# EAGLE schematic 4x16MUX_3 (EAGLE 6.5.0)

## Sheet 1 of 14
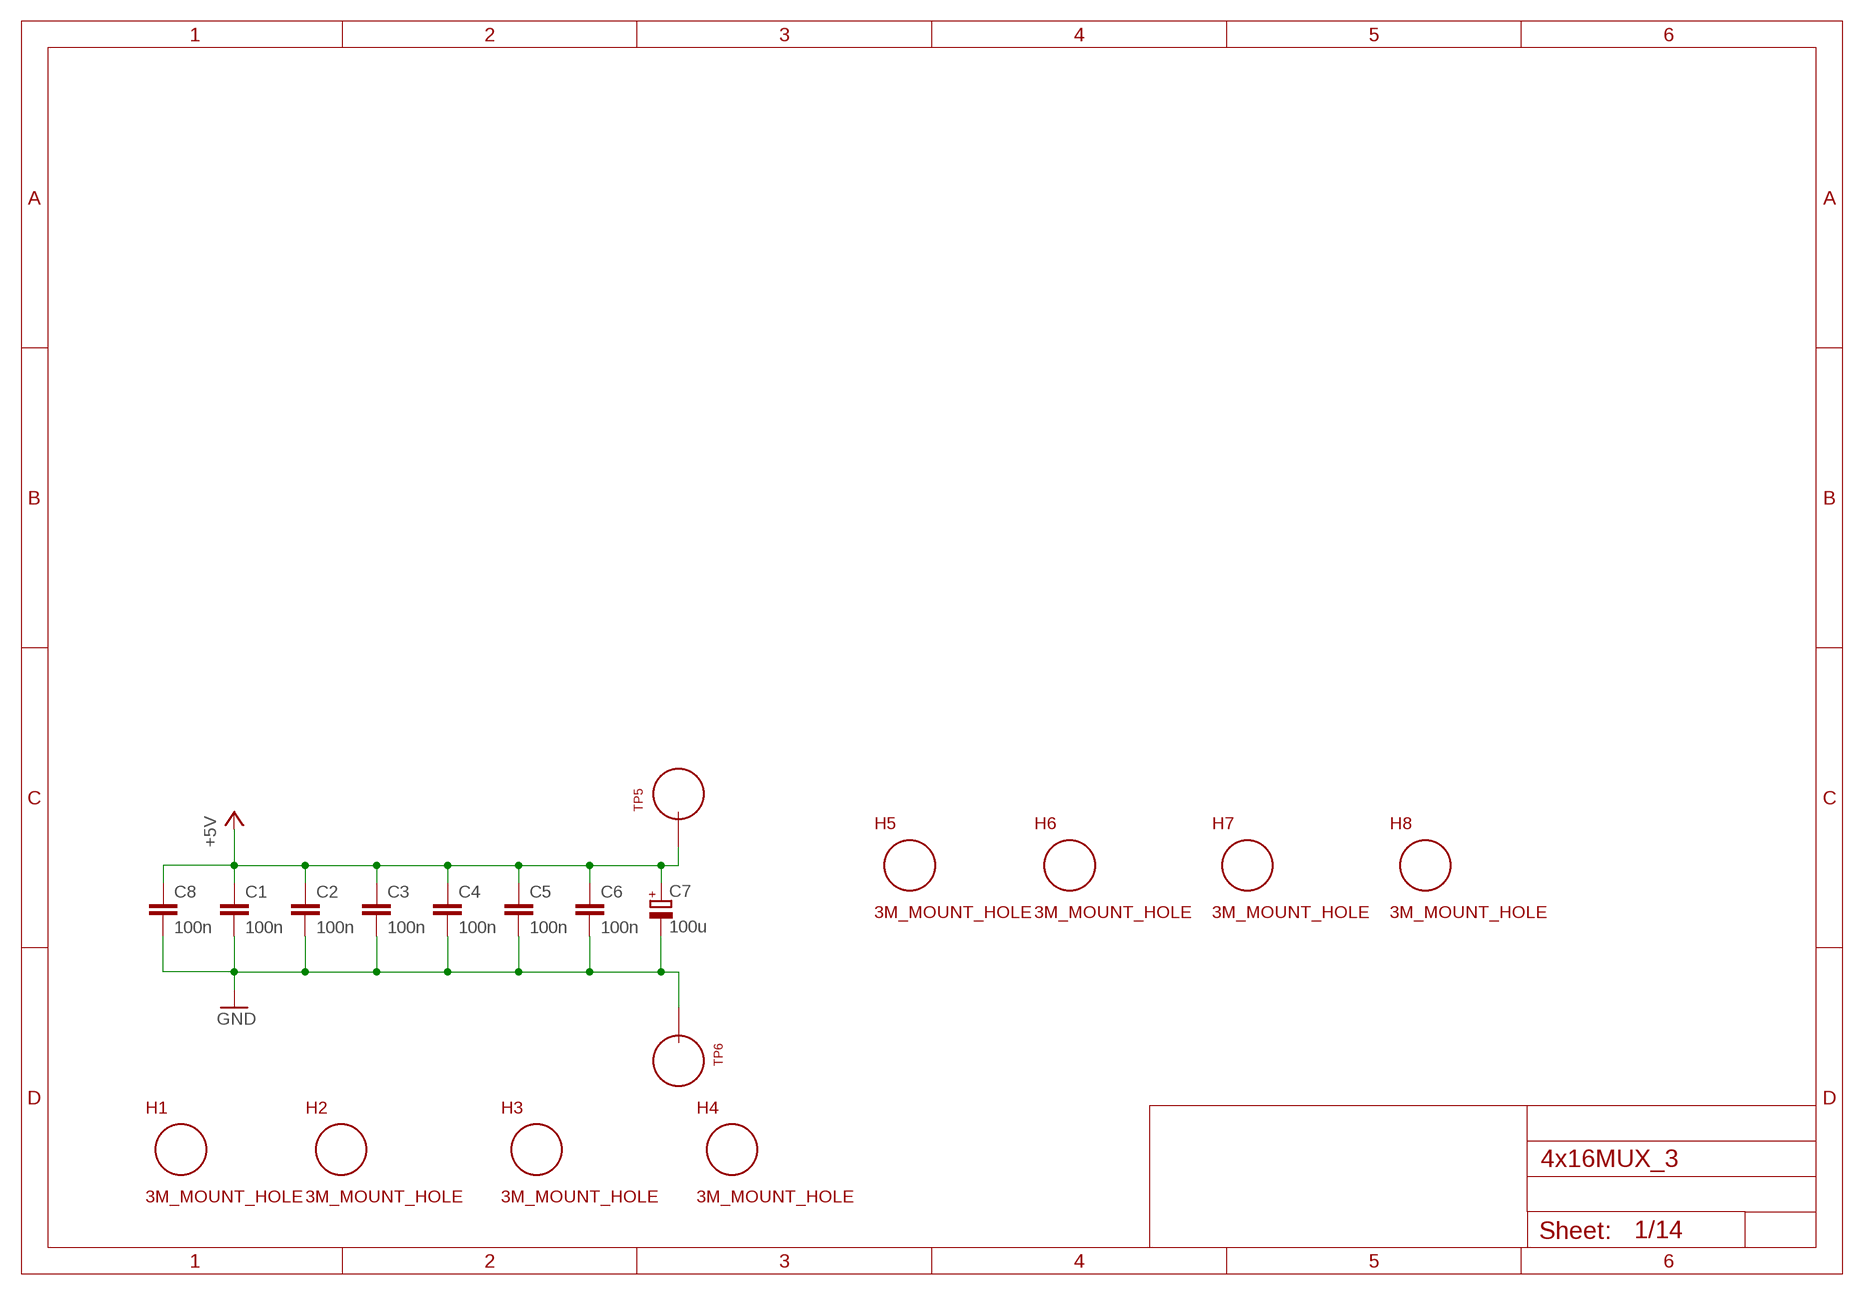
[diagram p0: schematic, sheet 1]

### Parts
C1  100n  C_P2INCH  [CAP_P2INCH]
C2  100n  C_P2INCH  [CAP_P2INCH]
C3  100n  C_P2INCH  [CAP_P2INCH]
C4  100n  C_P2INCH  [CAP_P2INCH]
C5  100n  C_P2INCH  [CAP_P2INCH]
C6  100n  C_P2INCH  [CAP_P2INCH]
C7  100u  POLARISED_CAP_2P5_6P3MM  [POLARISED_CAP_2P5_6P3MM]
C8  100n  C_P2INCH  [CAP_P2INCH]
H1  3M_MOUNT_HOLE  [3M_HOLE]
H2  3M_MOUNT_HOLE  [3M_HOLE]
H3  3M_MOUNT_HOLE  [3M_HOLE]
H4  3M_MOUNT_HOLE  [3M_HOLE]
H5  3M_MOUNT_HOLE  [3M_HOLE]
H6  3M_MOUNT_HOLE  [3M_HOLE]
H7  3M_MOUNT_HOLE  [3M_HOLE]
H8  3M_MOUNT_HOLE  [3M_HOLE]
TP5  TEST_LOOP  [TEST_LOOP]
TP6  TEST_LOOP  [TEST_LOOP]

### Nets
+5V: C1.1 C2.1 C3.1 C4.1 C5.1 C6.1 C7.A C8.1 TP5.P$1 ; also sheet 2,3,4,5,6,7,8,9,10,11,12,13,14
GND: C1.2 C2.2 C3.2 C4.2 C5.2 C6.2 C7.K C8.2 TP6.P$1 ; also sheet 2,3,4,5,6,7,8,9,10,11,12,13,14

## Sheet 2 of 14
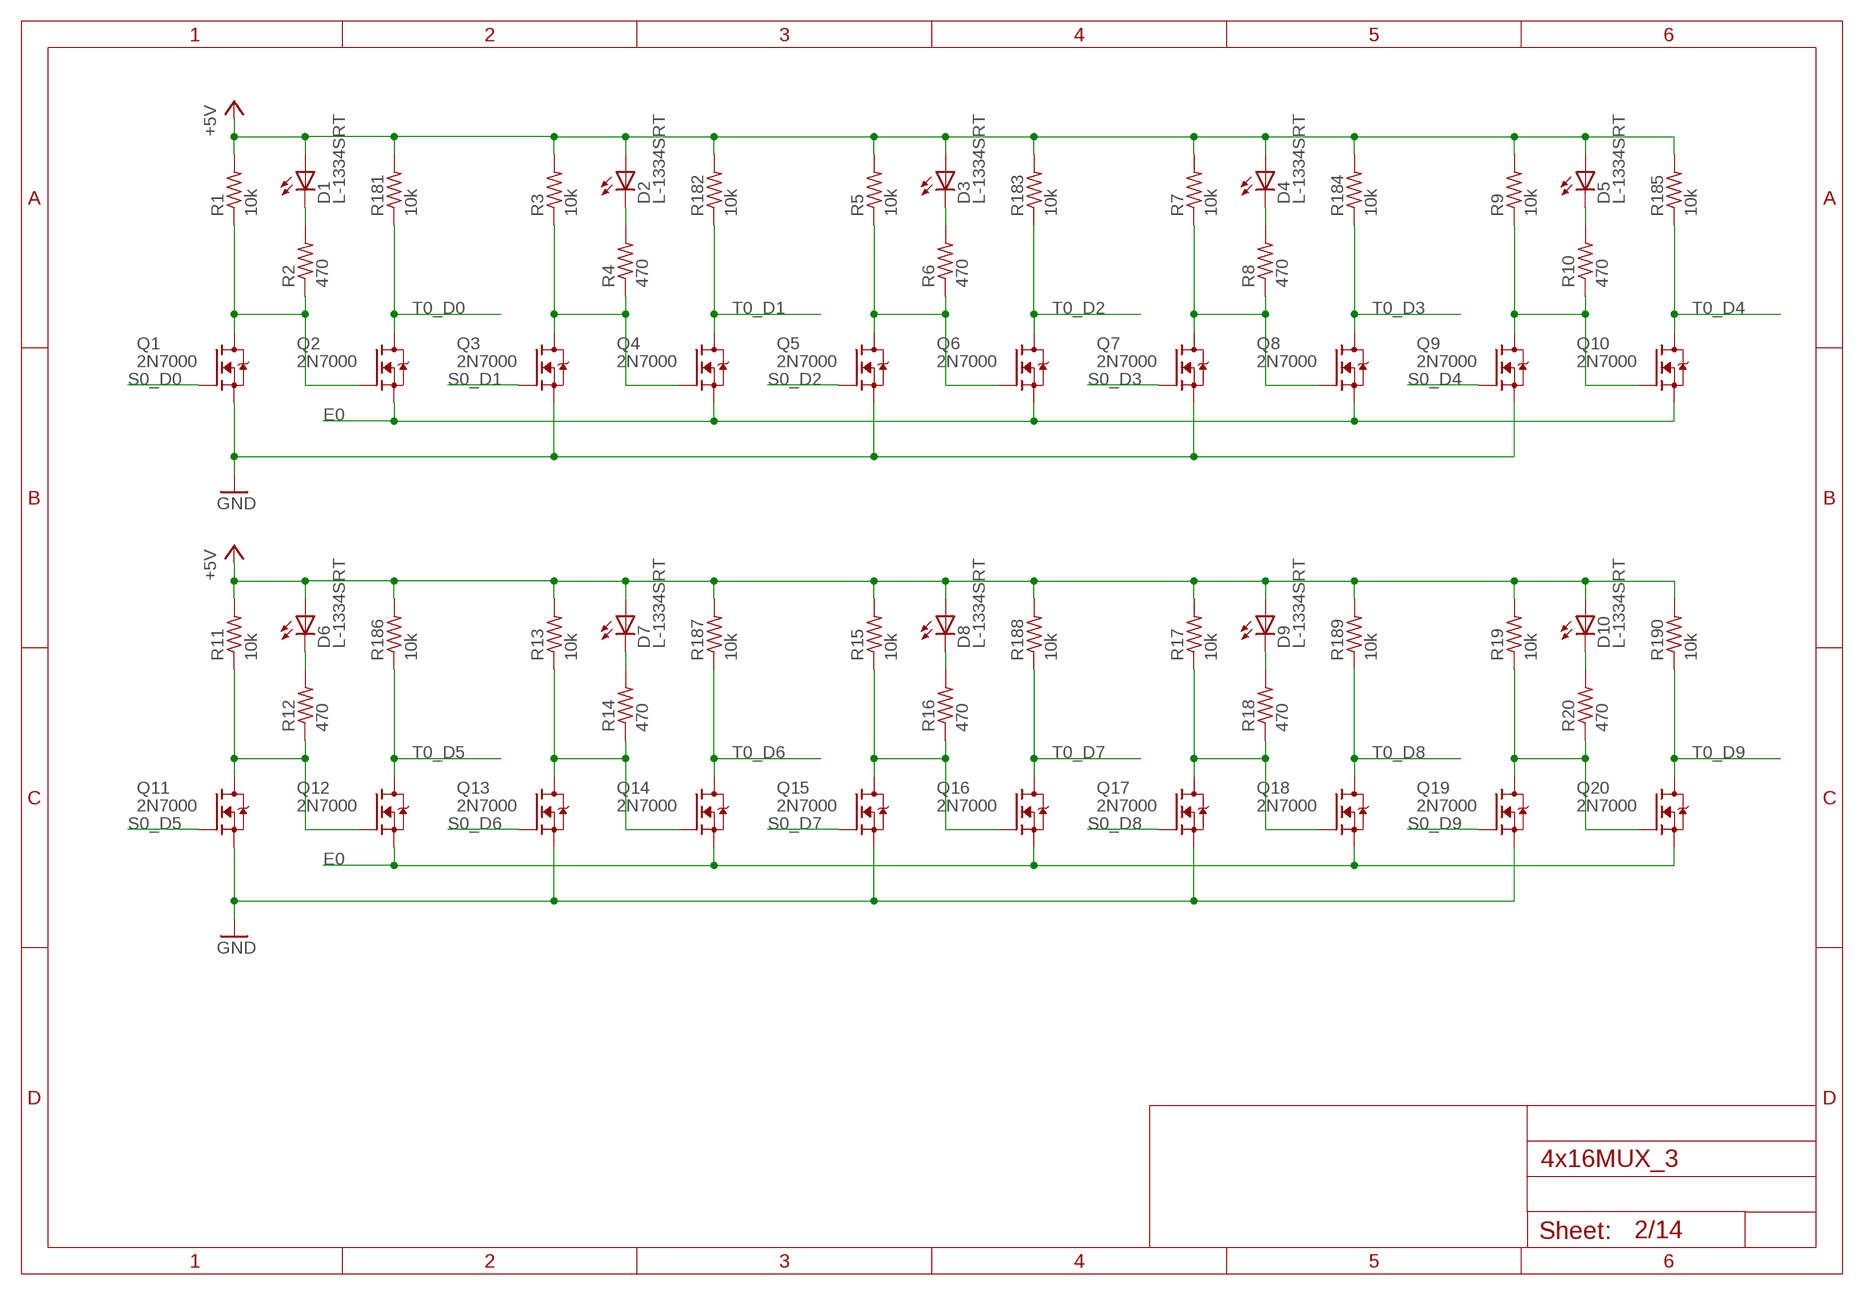
[diagram p1: schematic, sheet 2]

### Parts
D1  L-1334SRT  [LED3MM]
D2  L-1334SRT  [LED3MM]
D3  L-1334SRT  [LED3MM]
D4  L-1334SRT  [LED3MM]
D5  L-1334SRT  [LED3MM]
D6  L-1334SRT  [LED3MM]
D7  L-1334SRT  [LED3MM]
D8  L-1334SRT  [LED3MM]
D9  L-1334SRT  [LED3MM]
D10  L-1334SRT  [LED3MM]
Q1  2N7000  [TO92-DGS]
Q2  2N7000  [TO92-DGS]
Q3  2N7000  [TO92-DGS]
Q4  2N7000  [TO92-DGS]
Q5  2N7000  [TO92-DGS]
Q6  2N7000  [TO92-DGS]
Q7  2N7000  [TO92-DGS]
Q8  2N7000  [TO92-DGS]
Q9  2N7000  [TO92-DGS]
Q10  2N7000  [TO92-DGS]
Q11  2N7000  [TO92-DGS]
Q12  2N7000  [TO92-DGS]
Q13  2N7000  [TO92-DGS]
Q14  2N7000  [TO92-DGS]
Q15  2N7000  [TO92-DGS]
Q16  2N7000  [TO92-DGS]
Q17  2N7000  [TO92-DGS]
Q18  2N7000  [TO92-DGS]
Q19  2N7000  [TO92-DGS]
Q20  2N7000  [TO92-DGS]
R1  10k  R_P2INCH  [R_P2INCH]
R2  470  R_P2INCH  [R_P2INCH]
R3  10k  R_P2INCH  [R_P2INCH]
R4  470  R_P2INCH  [R_P2INCH]
R5  10k  R_P2INCH  [R_P2INCH]
R6  470  R_P2INCH  [R_P2INCH]
R7  10k  R_P2INCH  [R_P2INCH]
R8  470  R_P2INCH  [R_P2INCH]
R9  10k  R_P2INCH  [R_P2INCH]
R10  470  R_P2INCH  [R_P2INCH]
R11  10k  R_P2INCH  [R_P2INCH]
R12  470  R_P2INCH  [R_P2INCH]
R13  10k  R_P2INCH  [R_P2INCH]
R14  470  R_P2INCH  [R_P2INCH]
R15  10k  R_P2INCH  [R_P2INCH]
R16  470  R_P2INCH  [R_P2INCH]
R17  10k  R_P2INCH  [R_P2INCH]
R18  470  R_P2INCH  [R_P2INCH]
R19  10k  R_P2INCH  [R_P2INCH]
R20  470  R_P2INCH  [R_P2INCH]
R181  10k  R_P2INCH  [R_P2INCH]
R182  10k  R_P2INCH  [R_P2INCH]
R183  10k  R_P2INCH  [R_P2INCH]
R184  10k  R_P2INCH  [R_P2INCH]
R185  10k  R_P2INCH  [R_P2INCH]
R186  10k  R_P2INCH  [R_P2INCH]
R187  10k  R_P2INCH  [R_P2INCH]
R188  10k  R_P2INCH  [R_P2INCH]
R189  10k  R_P2INCH  [R_P2INCH]
R190  10k  R_P2INCH  [R_P2INCH]

### Nets
+5V: D1.A D2.A D3.A D4.A D5.A D6.A D7.A D8.A D9.A D10.A R1.2 R3.2 R5.2 R7.2 R9.2 R11.2 R13.2 R15.2 R17.2 R19.2 R181.2 R182.2 R183.2 R184.2 R185.2 R186.2 R187.2 R188.2 R189.2 R190.2 ; also sheet 1,3,4,5,6,7,8,9,10,11,12,13,14
E0: Q2.S Q4.S Q6.S Q8.S Q10.S Q12.S Q14.S Q16.S Q18.S Q20.S ; also sheet 3
GND: Q1.S Q3.S Q5.S Q7.S Q9.S Q11.S Q13.S Q15.S Q17.S Q19.S ; also sheet 1,3,4,5,6,7,8,9,10,11,12,13,14
N$1: Q3.D Q4.G R3.1 R4.1
N$2: Q1.D Q2.G R1.1 R2.1
N$3: D1.K(C) R2.2
N$4: D2.K(C) R4.2
N$5: Q5.D Q6.G R5.1 R6.1
N$6: D3.K(C) R6.2
N$7: Q7.D Q8.G R7.1 R8.1
N$8: D4.K(C) R8.2
N$9: Q9.D Q10.G R9.1 R10.1
N$10: D5.K(C) R10.2
N$12: Q11.D Q12.G R11.1 R12.1
N$13: D6.K(C) R12.2
N$14: Q13.D Q14.G R13.1 R14.1
N$15: D7.K(C) R14.2
N$16: Q15.D Q16.G R15.1 R16.1
N$17: D8.K(C) R16.2
N$18: Q17.D Q18.G R17.1 R18.1
N$19: D9.K(C) R18.2
N$20: Q19.D Q20.G R19.1 R20.1
N$21: D10.K(C) R20.2
S0_D0: Q1.G ; also sheet 3
S0_D1: Q3.G ; also sheet 3
S0_D2: Q5.G ; also sheet 3
S0_D3: Q7.G ; also sheet 3
S0_D4: Q9.G ; also sheet 3
S0_D5: Q11.G ; also sheet 3
S0_D6: Q13.G ; also sheet 3
S0_D7: Q15.G ; also sheet 3
S0_D8: Q17.G ; also sheet 3
S0_D9: Q19.G ; also sheet 3
T0_D0: Q2.D R181.1 ; also sheet 10
T0_D1: Q4.D R182.1 ; also sheet 10
T0_D2: Q6.D R183.1 ; also sheet 10
T0_D3: Q8.D R184.1 ; also sheet 10
T0_D4: Q10.D R185.1 ; also sheet 11
T0_D5: Q12.D R186.1 ; also sheet 11
T0_D6: Q14.D R187.1 ; also sheet 11
T0_D7: Q16.D R188.1 ; also sheet 11
T0_D8: Q18.D R189.1 ; also sheet 12
T0_D9: Q20.D R190.1 ; also sheet 12

## Sheet 3 of 14
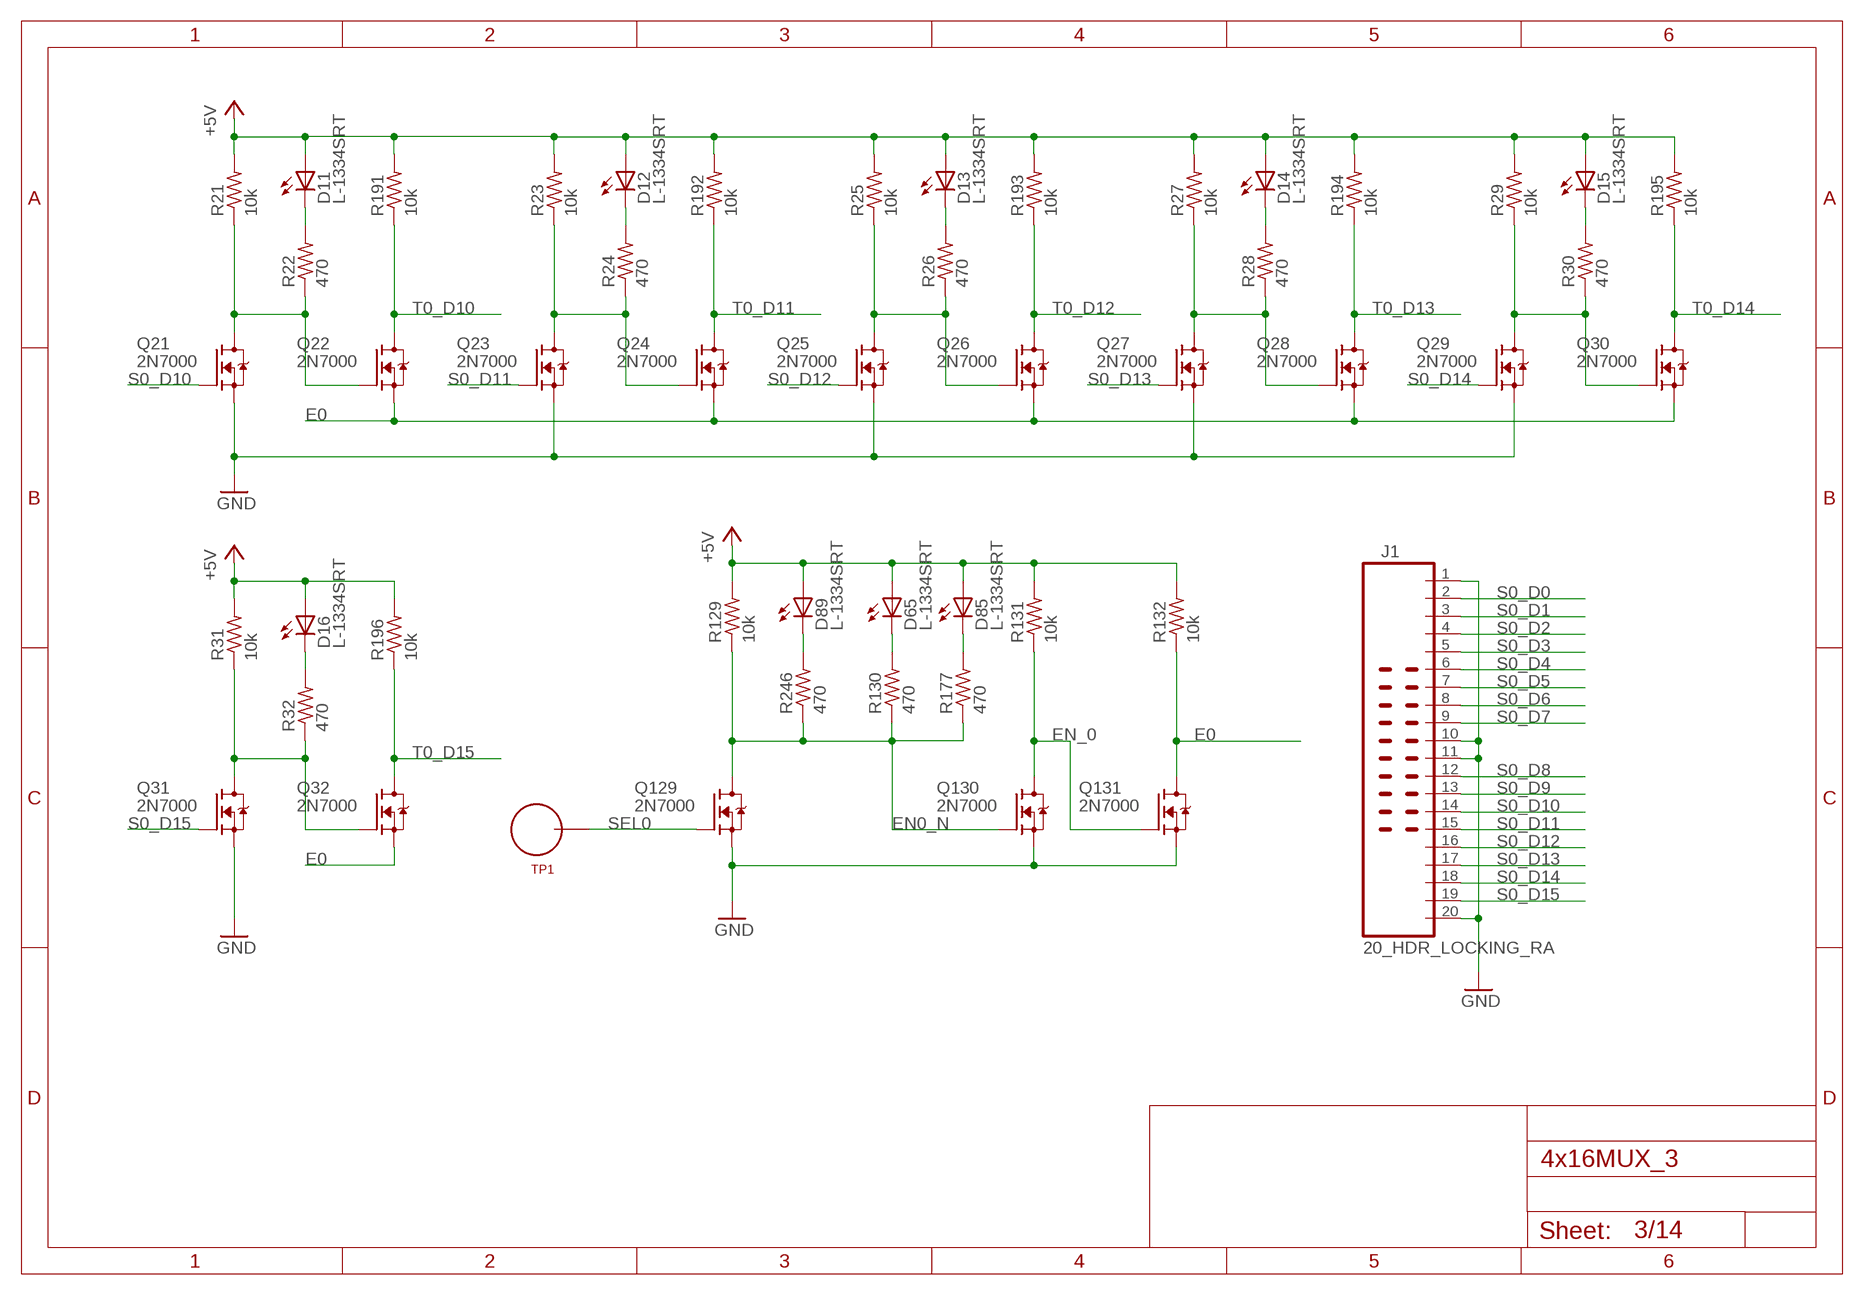
[diagram p2: schematic, sheet 3]

### Parts
D11  L-1334SRT  [LED3MM]
D12  L-1334SRT  [LED3MM]
D13  L-1334SRT  [LED3MM]
D14  L-1334SRT  [LED3MM]
D15  L-1334SRT  [LED3MM]
D16  L-1334SRT  [LED3MM]
D65  L-1334SRT  [LED3MM]
D85  L-1334SRT  [LED3MM]
D89  L-1334SRT  [LED3MM]
J1  20_HDR_LOCKING_RA  [20_HDR_LOCKING_RA]
Q21  2N7000  [TO92-DGS]
Q22  2N7000  [TO92-DGS]
Q23  2N7000  [TO92-DGS]
Q24  2N7000  [TO92-DGS]
Q25  2N7000  [TO92-DGS]
Q26  2N7000  [TO92-DGS]
Q27  2N7000  [TO92-DGS]
Q28  2N7000  [TO92-DGS]
Q29  2N7000  [TO92-DGS]
Q30  2N7000  [TO92-DGS]
Q31  2N7000  [TO92-DGS]
Q32  2N7000  [TO92-DGS]
Q129  2N7000  [TO92-DGS]
Q130  2N7000  [TO92-DGS]
Q131  2N7000  [TO92-DGS]
R21  10k  R_P2INCH  [R_P2INCH]
R22  470  R_P2INCH  [R_P2INCH]
R23  10k  R_P2INCH  [R_P2INCH]
R24  470  R_P2INCH  [R_P2INCH]
R25  10k  R_P2INCH  [R_P2INCH]
R26  470  R_P2INCH  [R_P2INCH]
R27  10k  R_P2INCH  [R_P2INCH]
R28  470  R_P2INCH  [R_P2INCH]
R29  10k  R_P2INCH  [R_P2INCH]
R30  470  R_P2INCH  [R_P2INCH]
R31  10k  R_P2INCH  [R_P2INCH]
R32  470  R_P2INCH  [R_P2INCH]
R129  10k  R_P2INCH  [R_P2INCH]
R130  470  R_P2INCH  [R_P2INCH]
R131  10k  R_P2INCH  [R_P2INCH]
R132  10k  R_P2INCH  [R_P2INCH]
R177  470  R_P2INCH  [R_P2INCH]
R191  10k  R_P2INCH  [R_P2INCH]
R192  10k  R_P2INCH  [R_P2INCH]
R193  10k  R_P2INCH  [R_P2INCH]
R194  10k  R_P2INCH  [R_P2INCH]
R195  10k  R_P2INCH  [R_P2INCH]
R196  10k  R_P2INCH  [R_P2INCH]
R246  470  R_P2INCH  [R_P2INCH]
TP1  TEST_LOOP  [TEST_LOOP]

### Nets
+5V: D11.A D12.A D13.A D14.A D15.A D16.A D65.A D85.A D89.A R21.2 R23.2 R25.2 R27.2 R29.2 R31.2 R129.2 R131.2 R132.2 R191.2 R192.2 R193.2 R194.2 R195.2 R196.2 ; also sheet 1,2,4,5,6,7,8,9,10,11,12,13,14
E0: Q22.S Q24.S Q26.S Q28.S Q30.S Q32.S Q131.D R132.1 ; also sheet 2
EN0_N: Q129.D Q130.G R129.1 R130.1 R177.1 R246.1 ; also sheet 14
EN_0: Q130.D Q131.G R131.1
GND: J1.1 J1.10 J1.11 J1.20 Q21.S Q23.S Q25.S Q27.S Q29.S Q31.S Q129.S Q130.S Q131.S ; also sheet 1,2,4,5,6,7,8,9,10,11,12,13,14
N$23: Q21.D Q22.G R21.1 R22.1
N$24: D11.K(C) R22.2
N$25: Q23.D Q24.G R23.1 R24.1
N$26: D12.K(C) R24.2
N$27: Q25.D Q26.G R25.1 R26.1
N$28: D13.K(C) R26.2
N$29: Q27.D Q28.G R27.1 R28.1
N$30: D14.K(C) R28.2
N$31: Q29.D Q30.G R29.1 R30.1
N$32: D15.K(C) R30.2
N$34: Q31.D Q32.G R31.1 R32.1
N$35: D16.K(C) R32.2
N$130: D65.K(C) R130.2
N$165: D85.K(C) R177.2
N$217: D89.K(C) R246.2
S0_D0: J1.2 ; also sheet 2
S0_D1: J1.3 ; also sheet 2
S0_D2: J1.4 ; also sheet 2
S0_D3: J1.5 ; also sheet 2
S0_D4: J1.6 ; also sheet 2
S0_D5: J1.7 ; also sheet 2
S0_D6: J1.8 ; also sheet 2
S0_D7: J1.9 ; also sheet 2
S0_D8: J1.12 ; also sheet 2
S0_D9: J1.13 ; also sheet 2
S0_D10: J1.14 Q21.G
S0_D11: J1.15 Q23.G
S0_D12: J1.16 Q25.G
S0_D13: J1.17 Q27.G
S0_D14: J1.18 Q29.G
S0_D15: J1.19 Q31.G
SEL0: Q129.G TP1.P$1
T0_D10: Q22.D R191.1 ; also sheet 12
T0_D11: Q24.D R192.1 ; also sheet 12
T0_D12: Q26.D R193.1 ; also sheet 13
T0_D13: Q28.D R194.1 ; also sheet 13
T0_D14: Q30.D R195.1 ; also sheet 13
T0_D15: Q32.D R196.1 ; also sheet 13

## Sheet 4 of 14
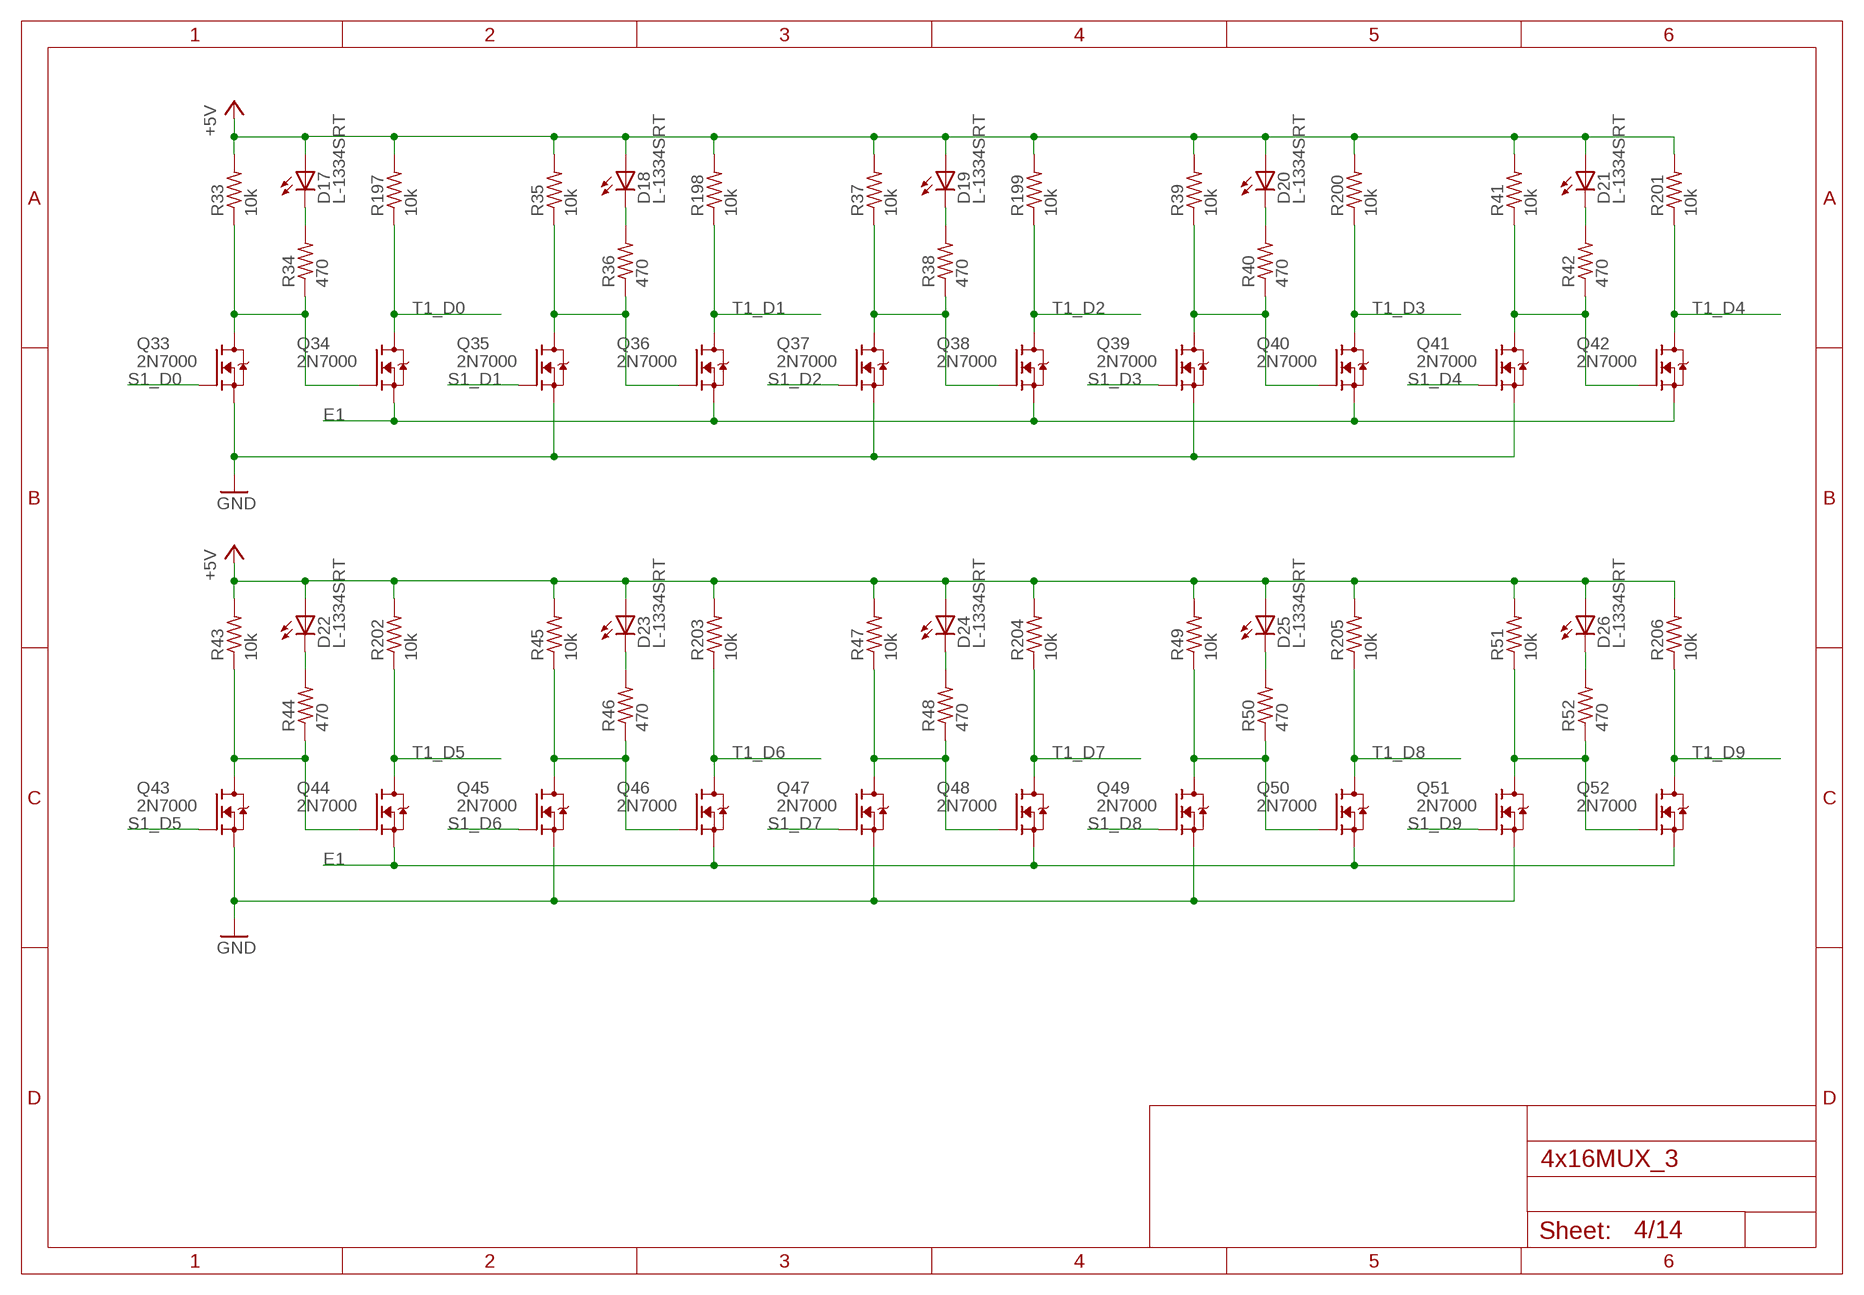
[diagram p3: schematic, sheet 4]

### Parts
D17  L-1334SRT  [LED3MM]
D18  L-1334SRT  [LED3MM]
D19  L-1334SRT  [LED3MM]
D20  L-1334SRT  [LED3MM]
D21  L-1334SRT  [LED3MM]
D22  L-1334SRT  [LED3MM]
D23  L-1334SRT  [LED3MM]
D24  L-1334SRT  [LED3MM]
D25  L-1334SRT  [LED3MM]
D26  L-1334SRT  [LED3MM]
Q33  2N7000  [TO92-DGS]
Q34  2N7000  [TO92-DGS]
Q35  2N7000  [TO92-DGS]
Q36  2N7000  [TO92-DGS]
Q37  2N7000  [TO92-DGS]
Q38  2N7000  [TO92-DGS]
Q39  2N7000  [TO92-DGS]
Q40  2N7000  [TO92-DGS]
Q41  2N7000  [TO92-DGS]
Q42  2N7000  [TO92-DGS]
Q43  2N7000  [TO92-DGS]
Q44  2N7000  [TO92-DGS]
Q45  2N7000  [TO92-DGS]
Q46  2N7000  [TO92-DGS]
Q47  2N7000  [TO92-DGS]
Q48  2N7000  [TO92-DGS]
Q49  2N7000  [TO92-DGS]
Q50  2N7000  [TO92-DGS]
Q51  2N7000  [TO92-DGS]
Q52  2N7000  [TO92-DGS]
R33  10k  R_P2INCH  [R_P2INCH]
R34  470  R_P2INCH  [R_P2INCH]
R35  10k  R_P2INCH  [R_P2INCH]
R36  470  R_P2INCH  [R_P2INCH]
R37  10k  R_P2INCH  [R_P2INCH]
R38  470  R_P2INCH  [R_P2INCH]
R39  10k  R_P2INCH  [R_P2INCH]
R40  470  R_P2INCH  [R_P2INCH]
R41  10k  R_P2INCH  [R_P2INCH]
R42  470  R_P2INCH  [R_P2INCH]
R43  10k  R_P2INCH  [R_P2INCH]
R44  470  R_P2INCH  [R_P2INCH]
R45  10k  R_P2INCH  [R_P2INCH]
R46  470  R_P2INCH  [R_P2INCH]
R47  10k  R_P2INCH  [R_P2INCH]
R48  470  R_P2INCH  [R_P2INCH]
R49  10k  R_P2INCH  [R_P2INCH]
R50  470  R_P2INCH  [R_P2INCH]
R51  10k  R_P2INCH  [R_P2INCH]
R52  470  R_P2INCH  [R_P2INCH]
R197  10k  R_P2INCH  [R_P2INCH]
R198  10k  R_P2INCH  [R_P2INCH]
R199  10k  R_P2INCH  [R_P2INCH]
R200  10k  R_P2INCH  [R_P2INCH]
R201  10k  R_P2INCH  [R_P2INCH]
R202  10k  R_P2INCH  [R_P2INCH]
R203  10k  R_P2INCH  [R_P2INCH]
R204  10k  R_P2INCH  [R_P2INCH]
R205  10k  R_P2INCH  [R_P2INCH]
R206  10k  R_P2INCH  [R_P2INCH]

### Nets
+5V: D17.A D18.A D19.A D20.A D21.A D22.A D23.A D24.A D25.A D26.A R33.2 R35.2 R37.2 R39.2 R41.2 R43.2 R45.2 R47.2 R49.2 R51.2 R197.2 R198.2 R199.2 R200.2 R201.2 R202.2 R203.2 R204.2 R205.2 R206.2 ; also sheet 1,2,3,5,6,7,8,9,10,11,12,13,14
E1: Q34.S Q36.S Q38.S Q40.S Q42.S Q44.S Q46.S Q48.S Q50.S Q52.S ; also sheet 5
GND: Q33.S Q35.S Q37.S Q39.S Q41.S Q43.S Q45.S Q47.S Q49.S Q51.S ; also sheet 1,2,3,5,6,7,8,9,10,11,12,13,14
N$11: Q33.D Q34.G R33.1 R34.1
N$22: D17.K(C) R34.2
N$33: Q35.D Q36.G R35.1 R36.1
N$36: D18.K(C) R36.2
N$37: Q37.D Q38.G R37.1 R38.1
N$38: D19.K(C) R38.2
N$39: Q39.D Q40.G R39.1 R40.1
N$40: D20.K(C) R40.2
N$41: Q41.D Q42.G R41.1 R42.1
N$42: D21.K(C) R42.2
N$43: Q43.D Q44.G R43.1 R44.1
N$44: D22.K(C) R44.2
N$45: Q45.D Q46.G R45.1 R46.1
N$46: D23.K(C) R46.2
N$47: Q47.D Q48.G R47.1 R48.1
N$48: D24.K(C) R48.2
N$49: Q49.D Q50.G R49.1 R50.1
N$50: D25.K(C) R50.2
N$51: Q51.D Q52.G R51.1 R52.1
N$52: D26.K(C) R52.2
S1_D0: Q33.G ; also sheet 5
S1_D1: Q35.G ; also sheet 5
S1_D2: Q37.G ; also sheet 5
S1_D3: Q39.G ; also sheet 5
S1_D4: Q41.G ; also sheet 5
S1_D5: Q43.G ; also sheet 5
S1_D6: Q45.G ; also sheet 5
S1_D7: Q47.G ; also sheet 5
S1_D8: Q49.G ; also sheet 5
S1_D9: Q51.G ; also sheet 5
T1_D0: Q34.D R197.1 ; also sheet 10
T1_D1: Q36.D R198.1 ; also sheet 10
T1_D2: Q38.D R199.1 ; also sheet 10
T1_D3: Q40.D R200.1 ; also sheet 10
T1_D4: Q42.D R201.1 ; also sheet 11
T1_D5: Q44.D R202.1 ; also sheet 11
T1_D6: Q46.D R203.1 ; also sheet 11
T1_D7: Q48.D R204.1 ; also sheet 11
T1_D8: Q50.D R205.1 ; also sheet 12
T1_D9: Q52.D R206.1 ; also sheet 12

## Sheet 5 of 14
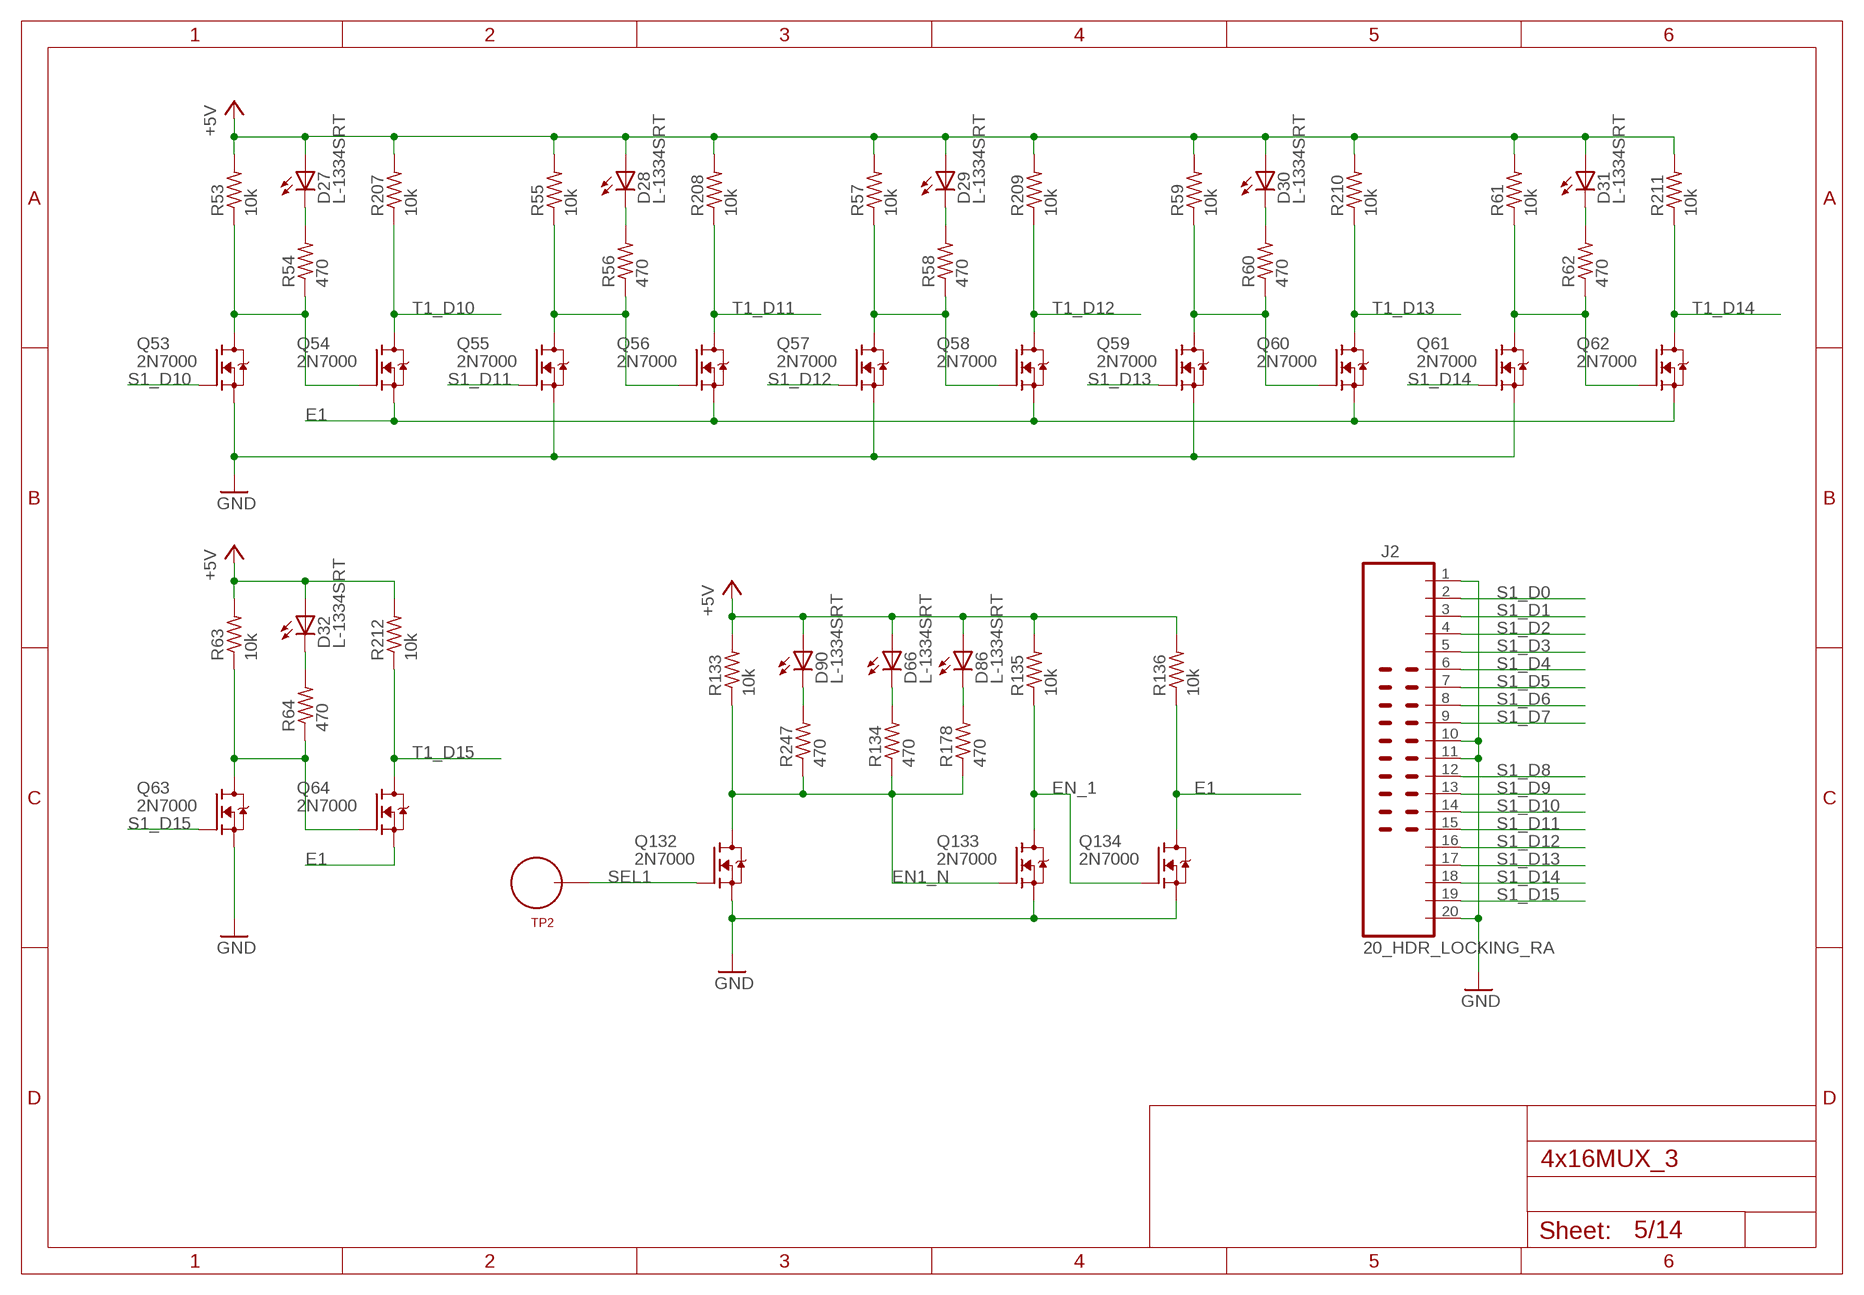
[diagram p4: schematic, sheet 5]

### Parts
D27  L-1334SRT  [LED3MM]
D28  L-1334SRT  [LED3MM]
D29  L-1334SRT  [LED3MM]
D30  L-1334SRT  [LED3MM]
D31  L-1334SRT  [LED3MM]
D32  L-1334SRT  [LED3MM]
D66  L-1334SRT  [LED3MM]
D86  L-1334SRT  [LED3MM]
D90  L-1334SRT  [LED3MM]
J2  20_HDR_LOCKING_RA  [20_HDR_LOCKING_RA]
Q53  2N7000  [TO92-DGS]
Q54  2N7000  [TO92-DGS]
Q55  2N7000  [TO92-DGS]
Q56  2N7000  [TO92-DGS]
Q57  2N7000  [TO92-DGS]
Q58  2N7000  [TO92-DGS]
Q59  2N7000  [TO92-DGS]
Q60  2N7000  [TO92-DGS]
Q61  2N7000  [TO92-DGS]
Q62  2N7000  [TO92-DGS]
Q63  2N7000  [TO92-DGS]
Q64  2N7000  [TO92-DGS]
Q132  2N7000  [TO92-DGS]
Q133  2N7000  [TO92-DGS]
Q134  2N7000  [TO92-DGS]
R53  10k  R_P2INCH  [R_P2INCH]
R54  470  R_P2INCH  [R_P2INCH]
R55  10k  R_P2INCH  [R_P2INCH]
R56  470  R_P2INCH  [R_P2INCH]
R57  10k  R_P2INCH  [R_P2INCH]
R58  470  R_P2INCH  [R_P2INCH]
R59  10k  R_P2INCH  [R_P2INCH]
R60  470  R_P2INCH  [R_P2INCH]
R61  10k  R_P2INCH  [R_P2INCH]
R62  470  R_P2INCH  [R_P2INCH]
R63  10k  R_P2INCH  [R_P2INCH]
R64  470  R_P2INCH  [R_P2INCH]
R133  10k  R_P2INCH  [R_P2INCH]
R134  470  R_P2INCH  [R_P2INCH]
R135  10k  R_P2INCH  [R_P2INCH]
R136  10k  R_P2INCH  [R_P2INCH]
R178  470  R_P2INCH  [R_P2INCH]
R207  10k  R_P2INCH  [R_P2INCH]
R208  10k  R_P2INCH  [R_P2INCH]
R209  10k  R_P2INCH  [R_P2INCH]
R210  10k  R_P2INCH  [R_P2INCH]
R211  10k  R_P2INCH  [R_P2INCH]
R212  10k  R_P2INCH  [R_P2INCH]
R247  470  R_P2INCH  [R_P2INCH]
TP2  TEST_LOOP  [TEST_LOOP]

### Nets
+5V: D27.A D28.A D29.A D30.A D31.A D32.A D66.A D86.A D90.A R53.2 R55.2 R57.2 R59.2 R61.2 R63.2 R133.2 R135.2 R136.2 R207.2 R208.2 R209.2 R210.2 R211.2 R212.2 ; also sheet 1,2,3,4,6,7,8,9,10,11,12,13,14
E1: Q54.S Q56.S Q58.S Q60.S Q62.S Q64.S Q134.D R136.1 ; also sheet 4
EN1_N: Q132.D Q133.G R133.1 R134.1 R178.1 R247.1 ; also sheet 14
EN_1: Q133.D Q134.G R135.1
GND: J2.1 J2.10 J2.11 J2.20 Q53.S Q55.S Q57.S Q59.S Q61.S Q63.S Q132.S Q133.S Q134.S ; also sheet 1,2,3,4,6,7,8,9,10,11,12,13,14
N$53: Q53.D Q54.G R53.1 R54.1
N$54: D27.K(C) R54.2
N$55: Q55.D Q56.G R55.1 R56.1
N$56: D28.K(C) R56.2
N$57: Q57.D Q58.G R57.1 R58.1
N$58: D29.K(C) R58.2
N$59: Q59.D Q60.G R59.1 R60.1
N$60: D30.K(C) R60.2
N$61: Q61.D Q62.G R61.1 R62.1
N$62: D31.K(C) R62.2
N$63: Q63.D Q64.G R63.1 R64.1
N$64: D32.K(C) R64.2
N$129: D66.K(C) R134.2
N$166: D86.K(C) R178.2
N$218: D90.K(C) R247.2
S1_D0: J2.2 ; also sheet 4
S1_D1: J2.3 ; also sheet 4
S1_D2: J2.4 ; also sheet 4
S1_D3: J2.5 ; also sheet 4
S1_D4: J2.6 ; also sheet 4
S1_D5: J2.7 ; also sheet 4
S1_D6: J2.8 ; also sheet 4
S1_D7: J2.9 ; also sheet 4
S1_D8: J2.12 ; also sheet 4
S1_D9: J2.13 ; also sheet 4
S1_D10: J2.14 Q53.G
S1_D11: J2.15 Q55.G
S1_D12: J2.16 Q57.G
S1_D13: J2.17 Q59.G
S1_D14: J2.18 Q61.G
S1_D15: J2.19 Q63.G
SEL1: Q132.G TP2.P$1
T1_D10: Q54.D R207.1 ; also sheet 12
T1_D11: Q56.D R208.1 ; also sheet 12
T1_D12: Q58.D R209.1 ; also sheet 13
T1_D13: Q60.D R210.1 ; also sheet 13
T1_D14: Q62.D R211.1 ; also sheet 13
T1_D15: Q64.D R212.1 ; also sheet 13

## Sheet 6 of 14
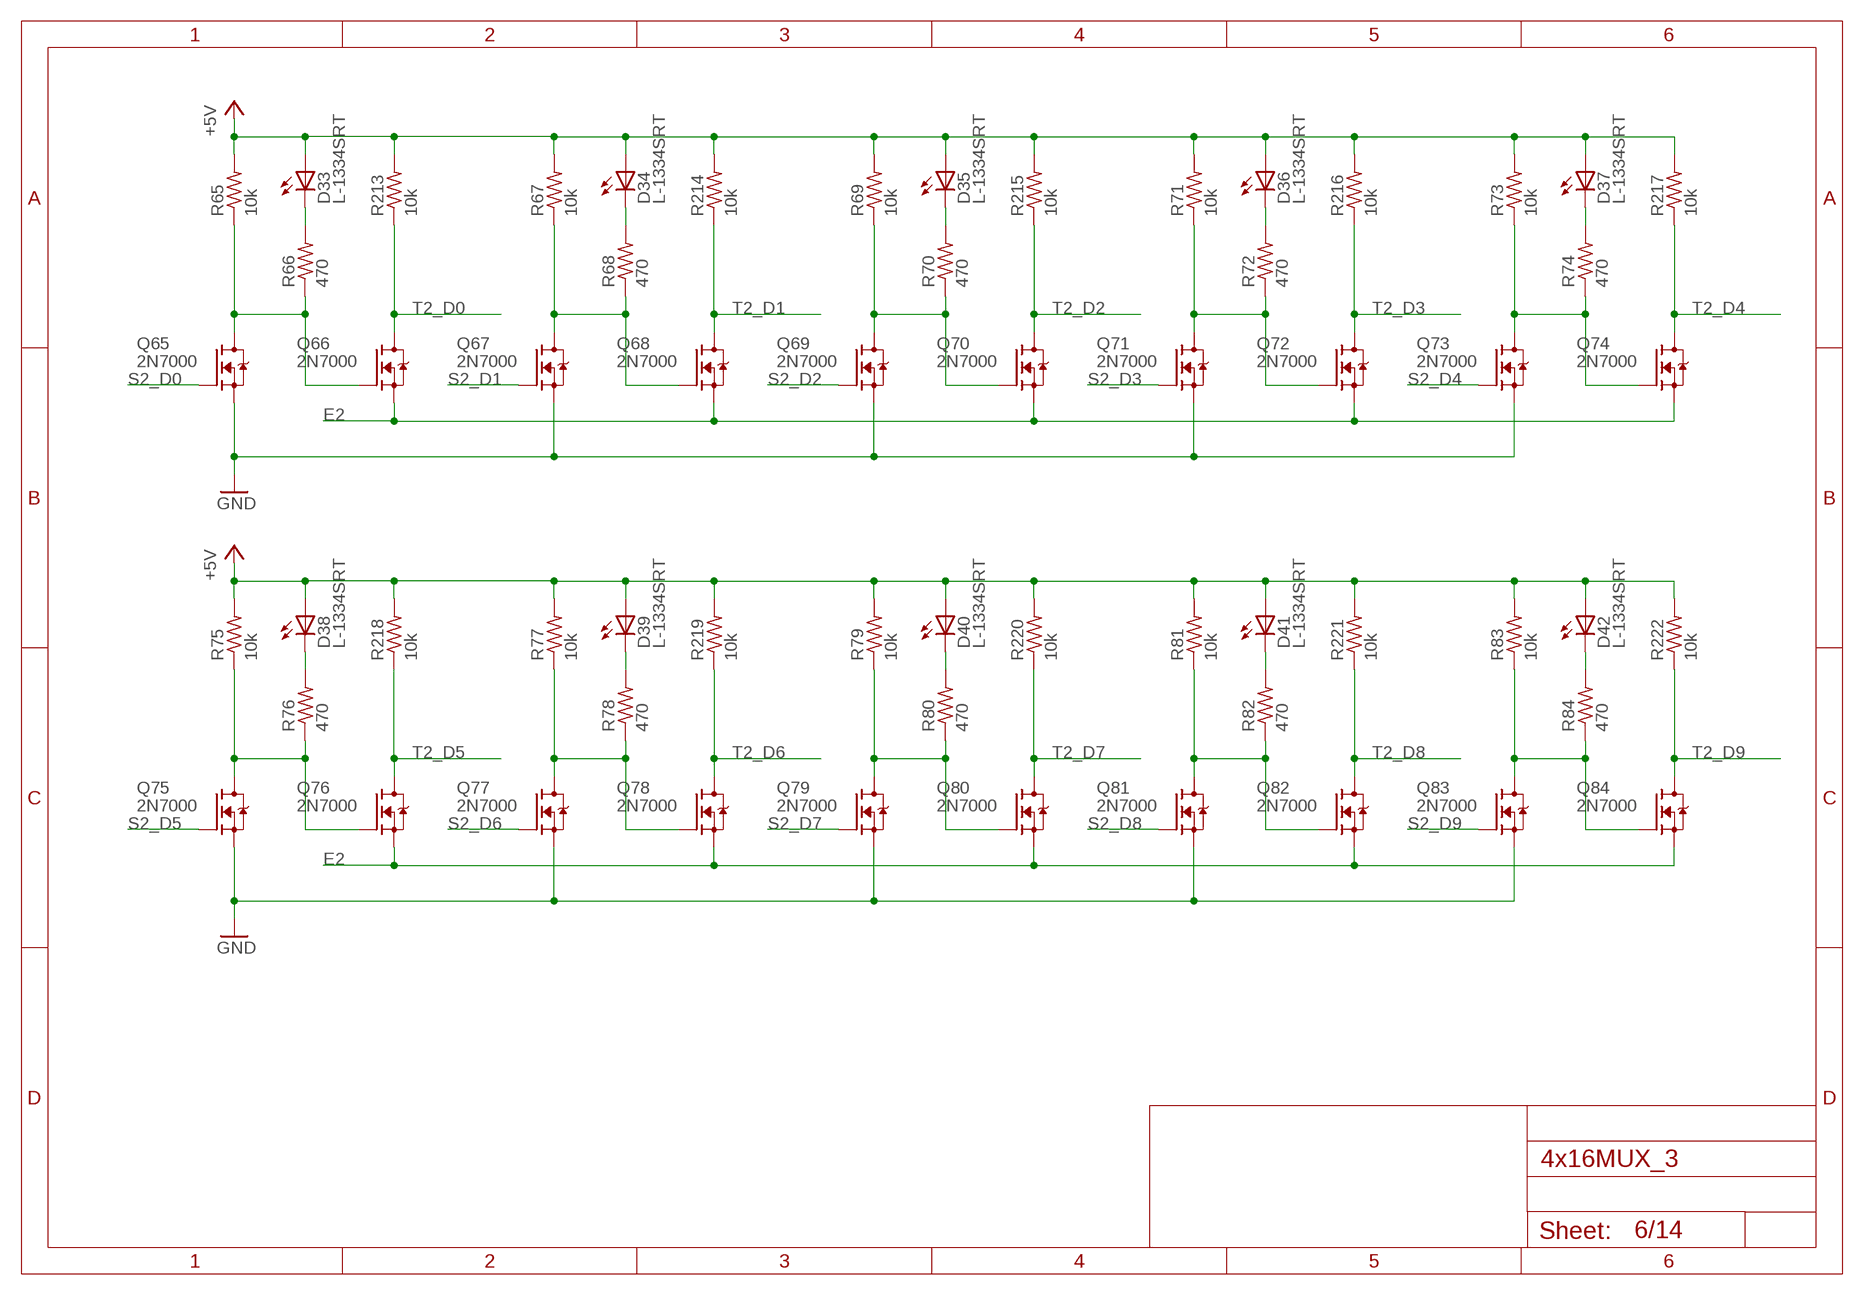
[diagram p5: schematic, sheet 6]

### Parts
D33  L-1334SRT  [LED3MM]
D34  L-1334SRT  [LED3MM]
D35  L-1334SRT  [LED3MM]
D36  L-1334SRT  [LED3MM]
D37  L-1334SRT  [LED3MM]
D38  L-1334SRT  [LED3MM]
D39  L-1334SRT  [LED3MM]
D40  L-1334SRT  [LED3MM]
D41  L-1334SRT  [LED3MM]
D42  L-1334SRT  [LED3MM]
Q65  2N7000  [TO92-DGS]
Q66  2N7000  [TO92-DGS]
Q67  2N7000  [TO92-DGS]
Q68  2N7000  [TO92-DGS]
Q69  2N7000  [TO92-DGS]
Q70  2N7000  [TO92-DGS]
Q71  2N7000  [TO92-DGS]
Q72  2N7000  [TO92-DGS]
Q73  2N7000  [TO92-DGS]
Q74  2N7000  [TO92-DGS]
Q75  2N7000  [TO92-DGS]
Q76  2N7000  [TO92-DGS]
Q77  2N7000  [TO92-DGS]
Q78  2N7000  [TO92-DGS]
Q79  2N7000  [TO92-DGS]
Q80  2N7000  [TO92-DGS]
Q81  2N7000  [TO92-DGS]
Q82  2N7000  [TO92-DGS]
Q83  2N7000  [TO92-DGS]
Q84  2N7000  [TO92-DGS]
R65  10k  R_P2INCH  [R_P2INCH]
R66  470  R_P2INCH  [R_P2INCH]
R67  10k  R_P2INCH  [R_P2INCH]
R68  470  R_P2INCH  [R_P2INCH]
R69  10k  R_P2INCH  [R_P2INCH]
R70  470  R_P2INCH  [R_P2INCH]
R71  10k  R_P2INCH  [R_P2INCH]
R72  470  R_P2INCH  [R_P2INCH]
R73  10k  R_P2INCH  [R_P2INCH]
R74  470  R_P2INCH  [R_P2INCH]
R75  10k  R_P2INCH  [R_P2INCH]
R76  470  R_P2INCH  [R_P2INCH]
R77  10k  R_P2INCH  [R_P2INCH]
R78  470  R_P2INCH  [R_P2INCH]
R79  10k  R_P2INCH  [R_P2INCH]
R80  470  R_P2INCH  [R_P2INCH]
R81  10k  R_P2INCH  [R_P2INCH]
R82  470  R_P2INCH  [R_P2INCH]
R83  10k  R_P2INCH  [R_P2INCH]
R84  470  R_P2INCH  [R_P2INCH]
R213  10k  R_P2INCH  [R_P2INCH]
R214  10k  R_P2INCH  [R_P2INCH]
R215  10k  R_P2INCH  [R_P2INCH]
R216  10k  R_P2INCH  [R_P2INCH]
R217  10k  R_P2INCH  [R_P2INCH]
R218  10k  R_P2INCH  [R_P2INCH]
R219  10k  R_P2INCH  [R_P2INCH]
R220  10k  R_P2INCH  [R_P2INCH]
R221  10k  R_P2INCH  [R_P2INCH]
R222  10k  R_P2INCH  [R_P2INCH]

### Nets
+5V: D33.A D34.A D35.A D36.A D37.A D38.A D39.A D40.A D41.A D42.A R65.2 R67.2 R69.2 R71.2 R73.2 R75.2 R77.2 R79.2 R81.2 R83.2 R213.2 R214.2 R215.2 R216.2 R217.2 R218.2 R219.2 R220.2 R221.2 R222.2 ; also sheet 1,2,3,4,5,7,8,9,10,11,12,13,14
E2: Q66.S Q68.S Q70.S Q72.S Q74.S Q76.S Q78.S Q80.S Q82.S Q84.S ; also sheet 7
GND: Q65.S Q67.S Q69.S Q71.S Q73.S Q75.S Q77.S Q79.S Q81.S Q83.S ; also sheet 1,2,3,4,5,7,8,9,10,11,12,13,14
N$65: Q65.D Q66.G R65.1 R66.1
N$66: D33.K(C) R66.2
N$67: Q67.D Q68.G R67.1 R68.1
N$68: D34.K(C) R68.2
N$69: Q69.D Q70.G R69.1 R70.1
N$70: D35.K(C) R70.2
N$71: Q71.D Q72.G R71.1 R72.1
N$72: D36.K(C) R72.2
N$73: Q73.D Q74.G R73.1 R74.1
N$74: D37.K(C) R74.2
N$75: Q75.D Q76.G R75.1 R76.1
N$76: D38.K(C) R76.2
N$77: Q77.D Q78.G R77.1 R78.1
N$78: D39.K(C) R78.2
N$79: Q79.D Q80.G R79.1 R80.1
N$80: D40.K(C) R80.2
N$81: Q81.D Q82.G R81.1 R82.1
N$82: D41.K(C) R82.2
N$83: Q83.D Q84.G R83.1 R84.1
N$84: D42.K(C) R84.2
S2_D0: Q65.G ; also sheet 7
S2_D1: Q67.G ; also sheet 7
S2_D2: Q69.G ; also sheet 7
S2_D3: Q71.G ; also sheet 7
S2_D4: Q73.G ; also sheet 7
S2_D5: Q75.G ; also sheet 7
S2_D6: Q77.G ; also sheet 7
S2_D7: Q79.G ; also sheet 7
S2_D8: Q81.G ; also sheet 7
S2_D9: Q83.G ; also sheet 7
T2_D0: Q66.D R213.1 ; also sheet 10
T2_D1: Q68.D R214.1 ; also sheet 10
T2_D2: Q70.D R215.1 ; also sheet 10
T2_D3: Q72.D R216.1 ; also sheet 10
T2_D4: Q74.D R217.1 ; also sheet 11
T2_D5: Q76.D R218.1 ; also sheet 11
T2_D6: Q78.D R219.1 ; also sheet 11
T2_D7: Q80.D R220.1 ; also sheet 11
T2_D8: Q82.D R221.1 ; also sheet 12
T2_D9: Q84.D R222.1 ; also sheet 12

## Sheet 7 of 14
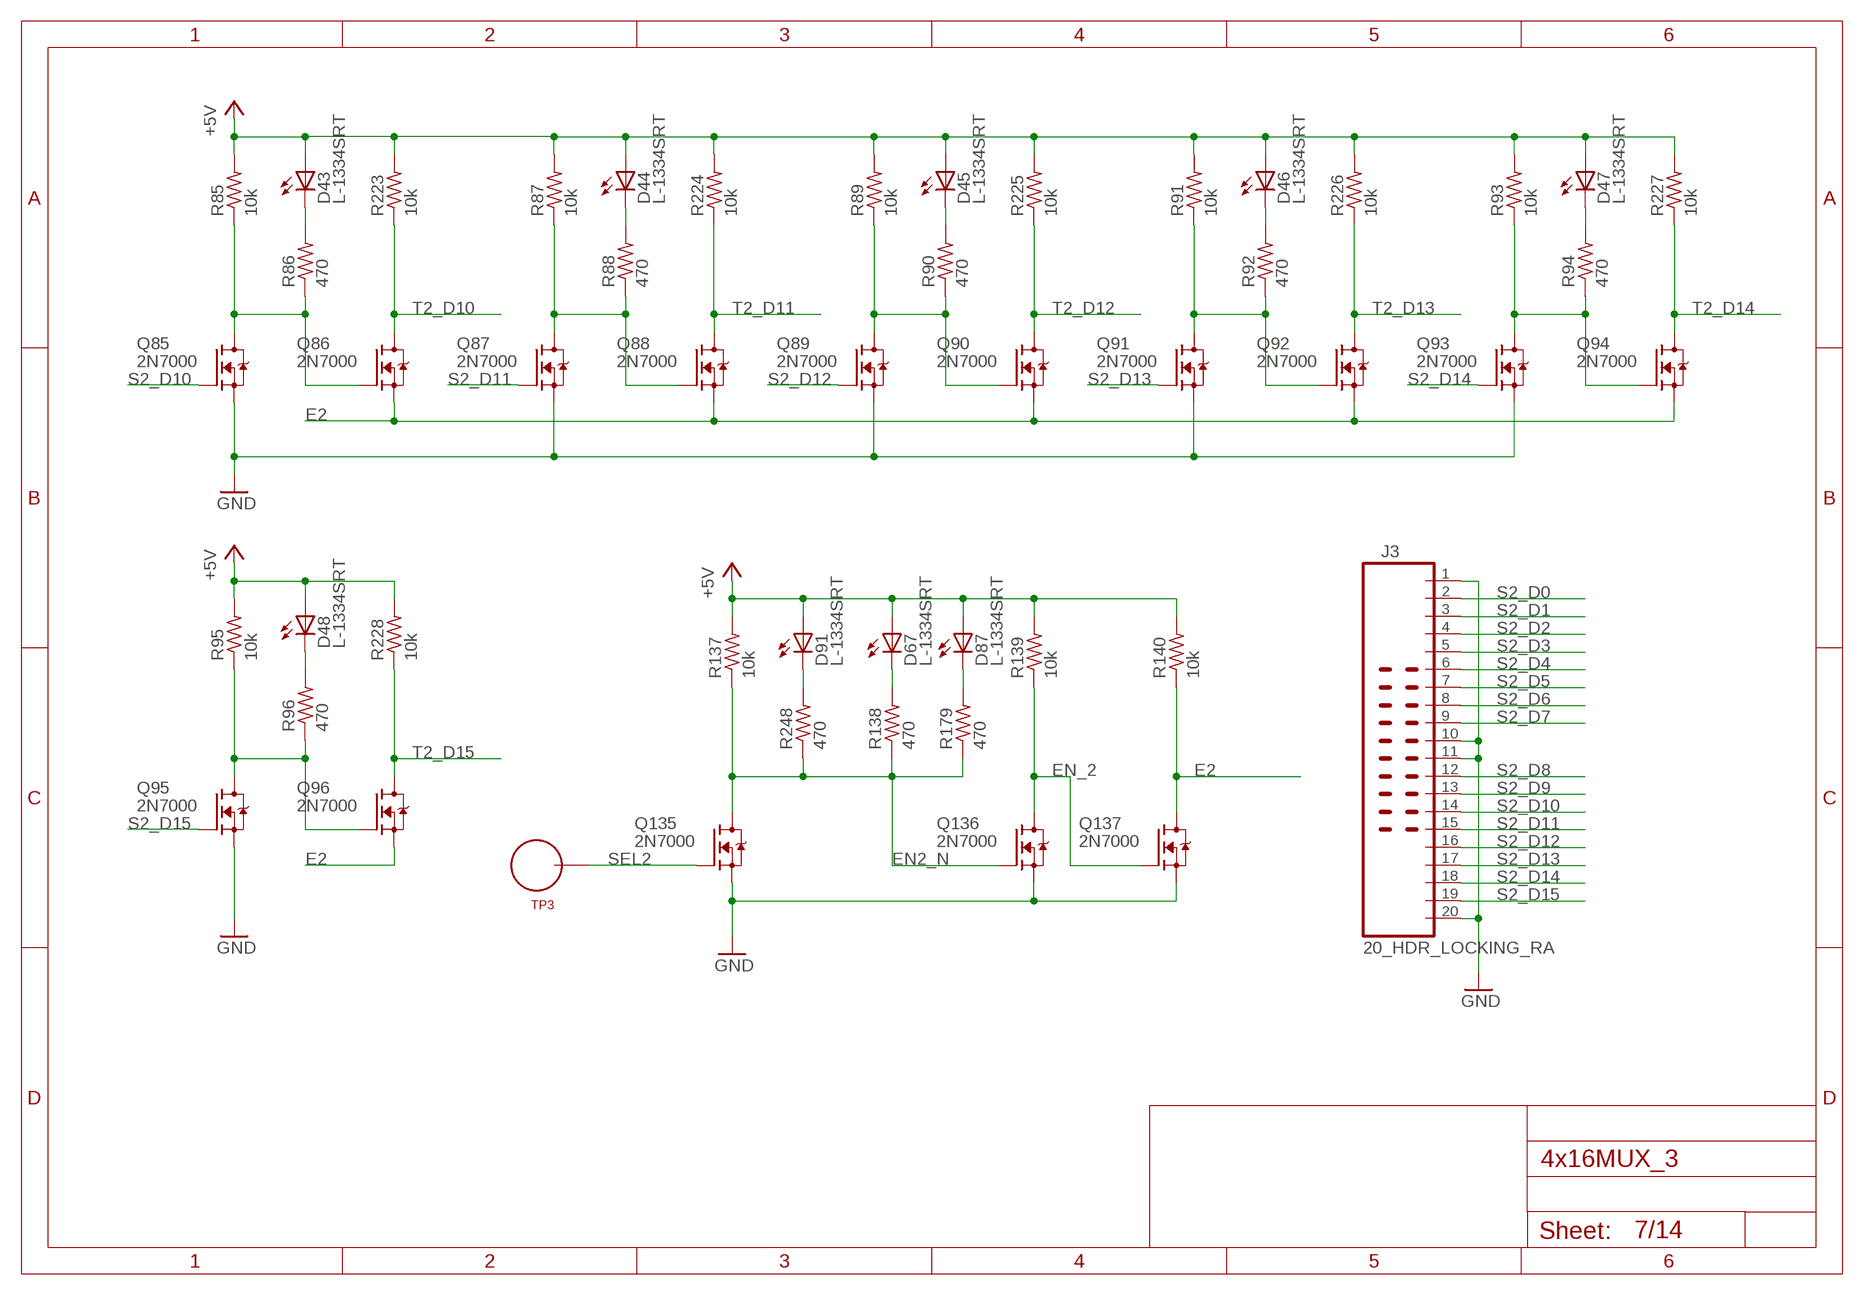
[diagram p6: schematic, sheet 7]

### Parts
D43  L-1334SRT  [LED3MM]
D44  L-1334SRT  [LED3MM]
D45  L-1334SRT  [LED3MM]
D46  L-1334SRT  [LED3MM]
D47  L-1334SRT  [LED3MM]
D48  L-1334SRT  [LED3MM]
D67  L-1334SRT  [LED3MM]
D87  L-1334SRT  [LED3MM]
D91  L-1334SRT  [LED3MM]
J3  20_HDR_LOCKING_RA  [20_HDR_LOCKING_RA]
Q85  2N7000  [TO92-DGS]
Q86  2N7000  [TO92-DGS]
Q87  2N7000  [TO92-DGS]
Q88  2N7000  [TO92-DGS]
Q89  2N7000  [TO92-DGS]
Q90  2N7000  [TO92-DGS]
Q91  2N7000  [TO92-DGS]
Q92  2N7000  [TO92-DGS]
Q93  2N7000  [TO92-DGS]
Q94  2N7000  [TO92-DGS]
Q95  2N7000  [TO92-DGS]
Q96  2N7000  [TO92-DGS]
Q135  2N7000  [TO92-DGS]
Q136  2N7000  [TO92-DGS]
Q137  2N7000  [TO92-DGS]
R85  10k  R_P2INCH  [R_P2INCH]
R86  470  R_P2INCH  [R_P2INCH]
R87  10k  R_P2INCH  [R_P2INCH]
R88  470  R_P2INCH  [R_P2INCH]
R89  10k  R_P2INCH  [R_P2INCH]
R90  470  R_P2INCH  [R_P2INCH]
R91  10k  R_P2INCH  [R_P2INCH]
R92  470  R_P2INCH  [R_P2INCH]
R93  10k  R_P2INCH  [R_P2INCH]
R94  470  R_P2INCH  [R_P2INCH]
R95  10k  R_P2INCH  [R_P2INCH]
R96  470  R_P2INCH  [R_P2INCH]
R137  10k  R_P2INCH  [R_P2INCH]
R138  470  R_P2INCH  [R_P2INCH]
R139  10k  R_P2INCH  [R_P2INCH]
R140  10k  R_P2INCH  [R_P2INCH]
R179  470  R_P2INCH  [R_P2INCH]
R223  10k  R_P2INCH  [R_P2INCH]
R224  10k  R_P2INCH  [R_P2INCH]
R225  10k  R_P2INCH  [R_P2INCH]
R226  10k  R_P2INCH  [R_P2INCH]
R227  10k  R_P2INCH  [R_P2INCH]
R228  10k  R_P2INCH  [R_P2INCH]
R248  470  R_P2INCH  [R_P2INCH]
TP3  TEST_LOOP  [TEST_LOOP]

### Nets
+5V: D43.A D44.A D45.A D46.A D47.A D48.A D67.A D87.A D91.A R85.2 R87.2 R89.2 R91.2 R93.2 R95.2 R137.2 R139.2 R140.2 R223.2 R224.2 R225.2 R226.2 R227.2 R228.2 ; also sheet 1,2,3,4,5,6,8,9,10,11,12,13,14
E2: Q86.S Q88.S Q90.S Q92.S Q94.S Q96.S Q137.D R140.1 ; also sheet 6
EN2_N: Q135.D Q136.G R137.1 R138.1 R179.1 R248.1 ; also sheet 14
EN_2: Q136.D Q137.G R139.1
GND: J3.1 J3.10 J3.11 J3.20 Q85.S Q87.S Q89.S Q91.S Q93.S Q95.S Q135.S Q136.S Q137.S ; also sheet 1,2,3,4,5,6,8,9,10,11,12,13,14
N$85: Q85.D Q86.G R85.1 R86.1
N$86: D43.K(C) R86.2
N$87: Q87.D Q88.G R87.1 R88.1
N$88: D44.K(C) R88.2
N$89: Q89.D Q90.G R89.1 R90.1
N$90: D45.K(C) R90.2
N$91: Q91.D Q92.G R91.1 R92.1
N$92: D46.K(C) R92.2
N$93: Q93.D Q94.G R93.1 R94.1
N$94: D47.K(C) R94.2
N$95: Q95.D Q96.G R95.1 R96.1
N$96: D48.K(C) R96.2
N$131: D67.K(C) R138.2
N$167: D87.K(C) R179.2
N$219: D91.K(C) R248.2
S2_D0: J3.2 ; also sheet 6
S2_D1: J3.3 ; also sheet 6
S2_D2: J3.4 ; also sheet 6
S2_D3: J3.5 ; also sheet 6
S2_D4: J3.6 ; also sheet 6
S2_D5: J3.7 ; also sheet 6
S2_D6: J3.8 ; also sheet 6
S2_D7: J3.9 ; also sheet 6
S2_D8: J3.12 ; also sheet 6
S2_D9: J3.13 ; also sheet 6
S2_D10: J3.14 Q85.G
S2_D11: J3.15 Q87.G
S2_D12: J3.16 Q89.G
S2_D13: J3.17 Q91.G
S2_D14: J3.18 Q93.G
S2_D15: J3.19 Q95.G
SEL2: Q135.G TP3.P$1
T2_D10: Q86.D R223.1 ; also sheet 12
T2_D11: Q88.D R224.1 ; also sheet 12
T2_D12: Q90.D R225.1 ; also sheet 13
T2_D13: Q92.D R226.1 ; also sheet 13
T2_D14: Q94.D R227.1 ; also sheet 13
T2_D15: Q96.D R228.1 ; also sheet 13

## Sheet 8 of 14
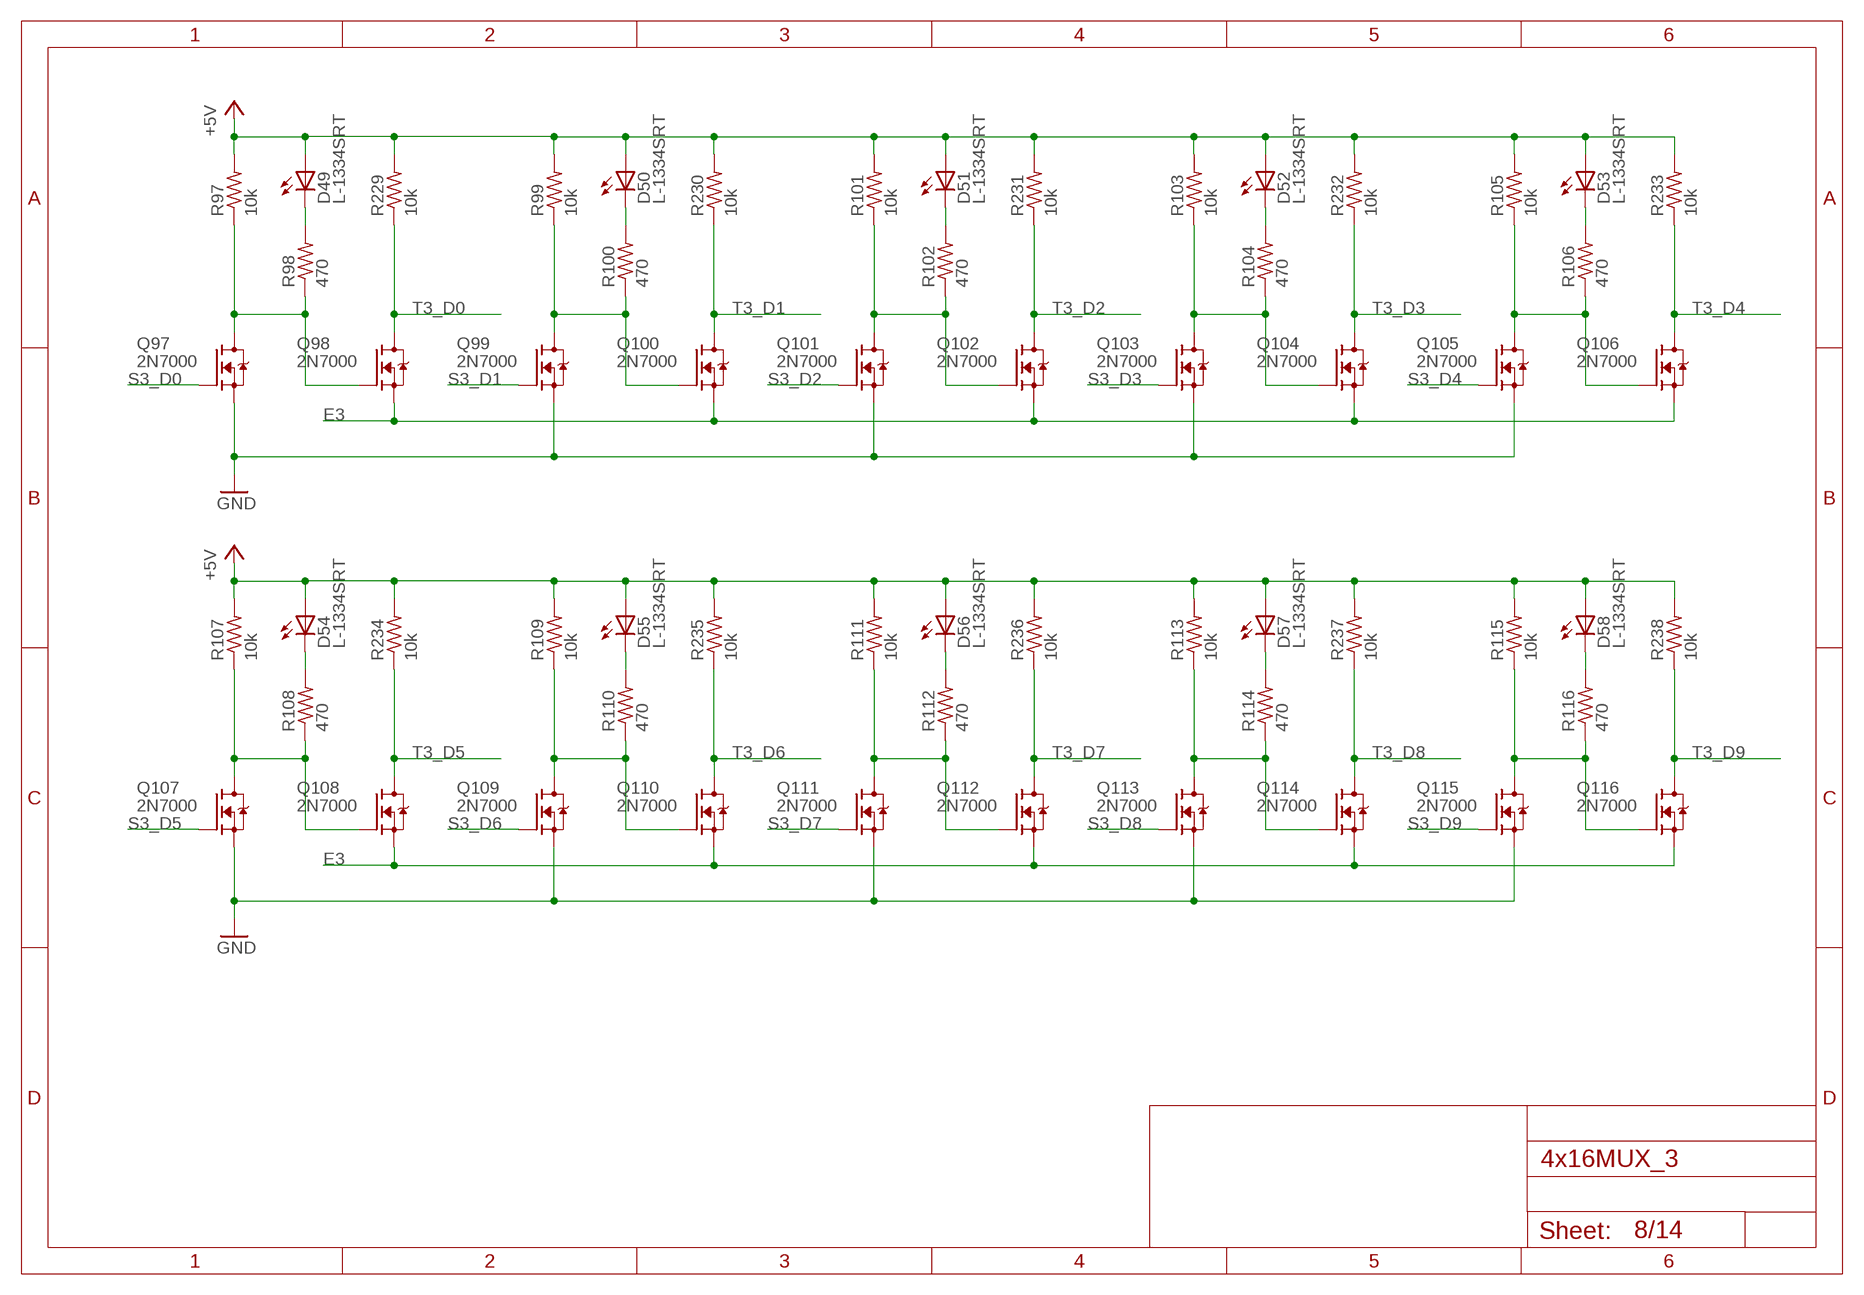
[diagram p7: schematic, sheet 8]

### Parts
D49  L-1334SRT  [LED3MM]
D50  L-1334SRT  [LED3MM]
D51  L-1334SRT  [LED3MM]
D52  L-1334SRT  [LED3MM]
D53  L-1334SRT  [LED3MM]
D54  L-1334SRT  [LED3MM]
D55  L-1334SRT  [LED3MM]
D56  L-1334SRT  [LED3MM]
D57  L-1334SRT  [LED3MM]
D58  L-1334SRT  [LED3MM]
Q97  2N7000  [TO92-DGS]
Q98  2N7000  [TO92-DGS]
Q99  2N7000  [TO92-DGS]
Q100  2N7000  [TO92-DGS]
Q101  2N7000  [TO92-DGS]
Q102  2N7000  [TO92-DGS]
Q103  2N7000  [TO92-DGS]
Q104  2N7000  [TO92-DGS]
Q105  2N7000  [TO92-DGS]
Q106  2N7000  [TO92-DGS]
Q107  2N7000  [TO92-DGS]
Q108  2N7000  [TO92-DGS]
Q109  2N7000  [TO92-DGS]
Q110  2N7000  [TO92-DGS]
Q111  2N7000  [TO92-DGS]
Q112  2N7000  [TO92-DGS]
Q113  2N7000  [TO92-DGS]
Q114  2N7000  [TO92-DGS]
Q115  2N7000  [TO92-DGS]
Q116  2N7000  [TO92-DGS]
R97  10k  R_P2INCH  [R_P2INCH]
R98  470  R_P2INCH  [R_P2INCH]
R99  10k  R_P2INCH  [R_P2INCH]
R100  470  R_P2INCH  [R_P2INCH]
R101  10k  R_P2INCH  [R_P2INCH]
R102  470  R_P2INCH  [R_P2INCH]
R103  10k  R_P2INCH  [R_P2INCH]
R104  470  R_P2INCH  [R_P2INCH]
R105  10k  R_P2INCH  [R_P2INCH]
R106  470  R_P2INCH  [R_P2INCH]
R107  10k  R_P2INCH  [R_P2INCH]
R108  470  R_P2INCH  [R_P2INCH]
R109  10k  R_P2INCH  [R_P2INCH]
R110  470  R_P2INCH  [R_P2INCH]
R111  10k  R_P2INCH  [R_P2INCH]
R112  470  R_P2INCH  [R_P2INCH]
R113  10k  R_P2INCH  [R_P2INCH]
R114  470  R_P2INCH  [R_P2INCH]
R115  10k  R_P2INCH  [R_P2INCH]
R116  470  R_P2INCH  [R_P2INCH]
R229  10k  R_P2INCH  [R_P2INCH]
R230  10k  R_P2INCH  [R_P2INCH]
R231  10k  R_P2INCH  [R_P2INCH]
R232  10k  R_P2INCH  [R_P2INCH]
R233  10k  R_P2INCH  [R_P2INCH]
R234  10k  R_P2INCH  [R_P2INCH]
R235  10k  R_P2INCH  [R_P2INCH]
R236  10k  R_P2INCH  [R_P2INCH]
R237  10k  R_P2INCH  [R_P2INCH]
R238  10k  R_P2INCH  [R_P2INCH]

### Nets
+5V: D49.A D50.A D51.A D52.A D53.A D54.A D55.A D56.A D57.A D58.A R97.2 R99.2 R101.2 R103.2 R105.2 R107.2 R109.2 R111.2 R113.2 R115.2 R229.2 R230.2 R231.2 R232.2 R233.2 R234.2 R235.2 R236.2 R237.2 R238.2 ; also sheet 1,2,3,4,5,6,7,9,10,11,12,13,14
E3: Q98.S Q100.S Q102.S Q104.S Q106.S Q108.S Q110.S Q112.S Q114.S Q116.S ; also sheet 9
GND: Q97.S Q99.S Q101.S Q103.S Q105.S Q107.S Q109.S Q111.S Q113.S Q115.S ; also sheet 1,2,3,4,5,6,7,9,10,11,12,13,14
N$97: Q97.D Q98.G R97.1 R98.1
N$98: D49.K(C) R98.2
N$99: Q99.D Q100.G R99.1 R100.1
N$100: D50.K(C) R100.2
N$101: Q101.D Q102.G R101.1 R102.1
N$102: D51.K(C) R102.2
N$103: Q103.D Q104.G R103.1 R104.1
N$104: D52.K(C) R104.2
N$105: Q105.D Q106.G R105.1 R106.1
N$106: D53.K(C) R106.2
N$107: Q107.D Q108.G R107.1 R108.1
N$108: D54.K(C) R108.2
N$109: Q109.D Q110.G R109.1 R110.1
N$110: D55.K(C) R110.2
N$111: Q111.D Q112.G R111.1 R112.1
N$112: D56.K(C) R112.2
N$113: Q113.D Q114.G R113.1 R114.1
N$114: D57.K(C) R114.2
N$115: Q115.D Q116.G R115.1 R116.1
N$116: D58.K(C) R116.2
S3_D0: Q97.G ; also sheet 9
S3_D1: Q99.G ; also sheet 9
S3_D2: Q101.G ; also sheet 9
S3_D3: Q103.G ; also sheet 9
S3_D4: Q105.G ; also sheet 9
S3_D5: Q107.G ; also sheet 9
S3_D6: Q109.G ; also sheet 9
S3_D7: Q111.G ; also sheet 9
S3_D8: Q113.G ; also sheet 9
S3_D9: Q115.G ; also sheet 9
T3_D0: Q98.D R229.1 ; also sheet 10
T3_D1: Q100.D R230.1 ; also sheet 10
T3_D2: Q102.D R231.1 ; also sheet 10
T3_D3: Q104.D R232.1 ; also sheet 10
T3_D4: Q106.D R233.1 ; also sheet 11
T3_D5: Q108.D R234.1 ; also sheet 11
T3_D6: Q110.D R235.1 ; also sheet 11
T3_D7: Q112.D R236.1 ; also sheet 11
T3_D8: Q114.D R237.1 ; also sheet 12
T3_D9: Q116.D R238.1 ; also sheet 12

## Sheet 9 of 14
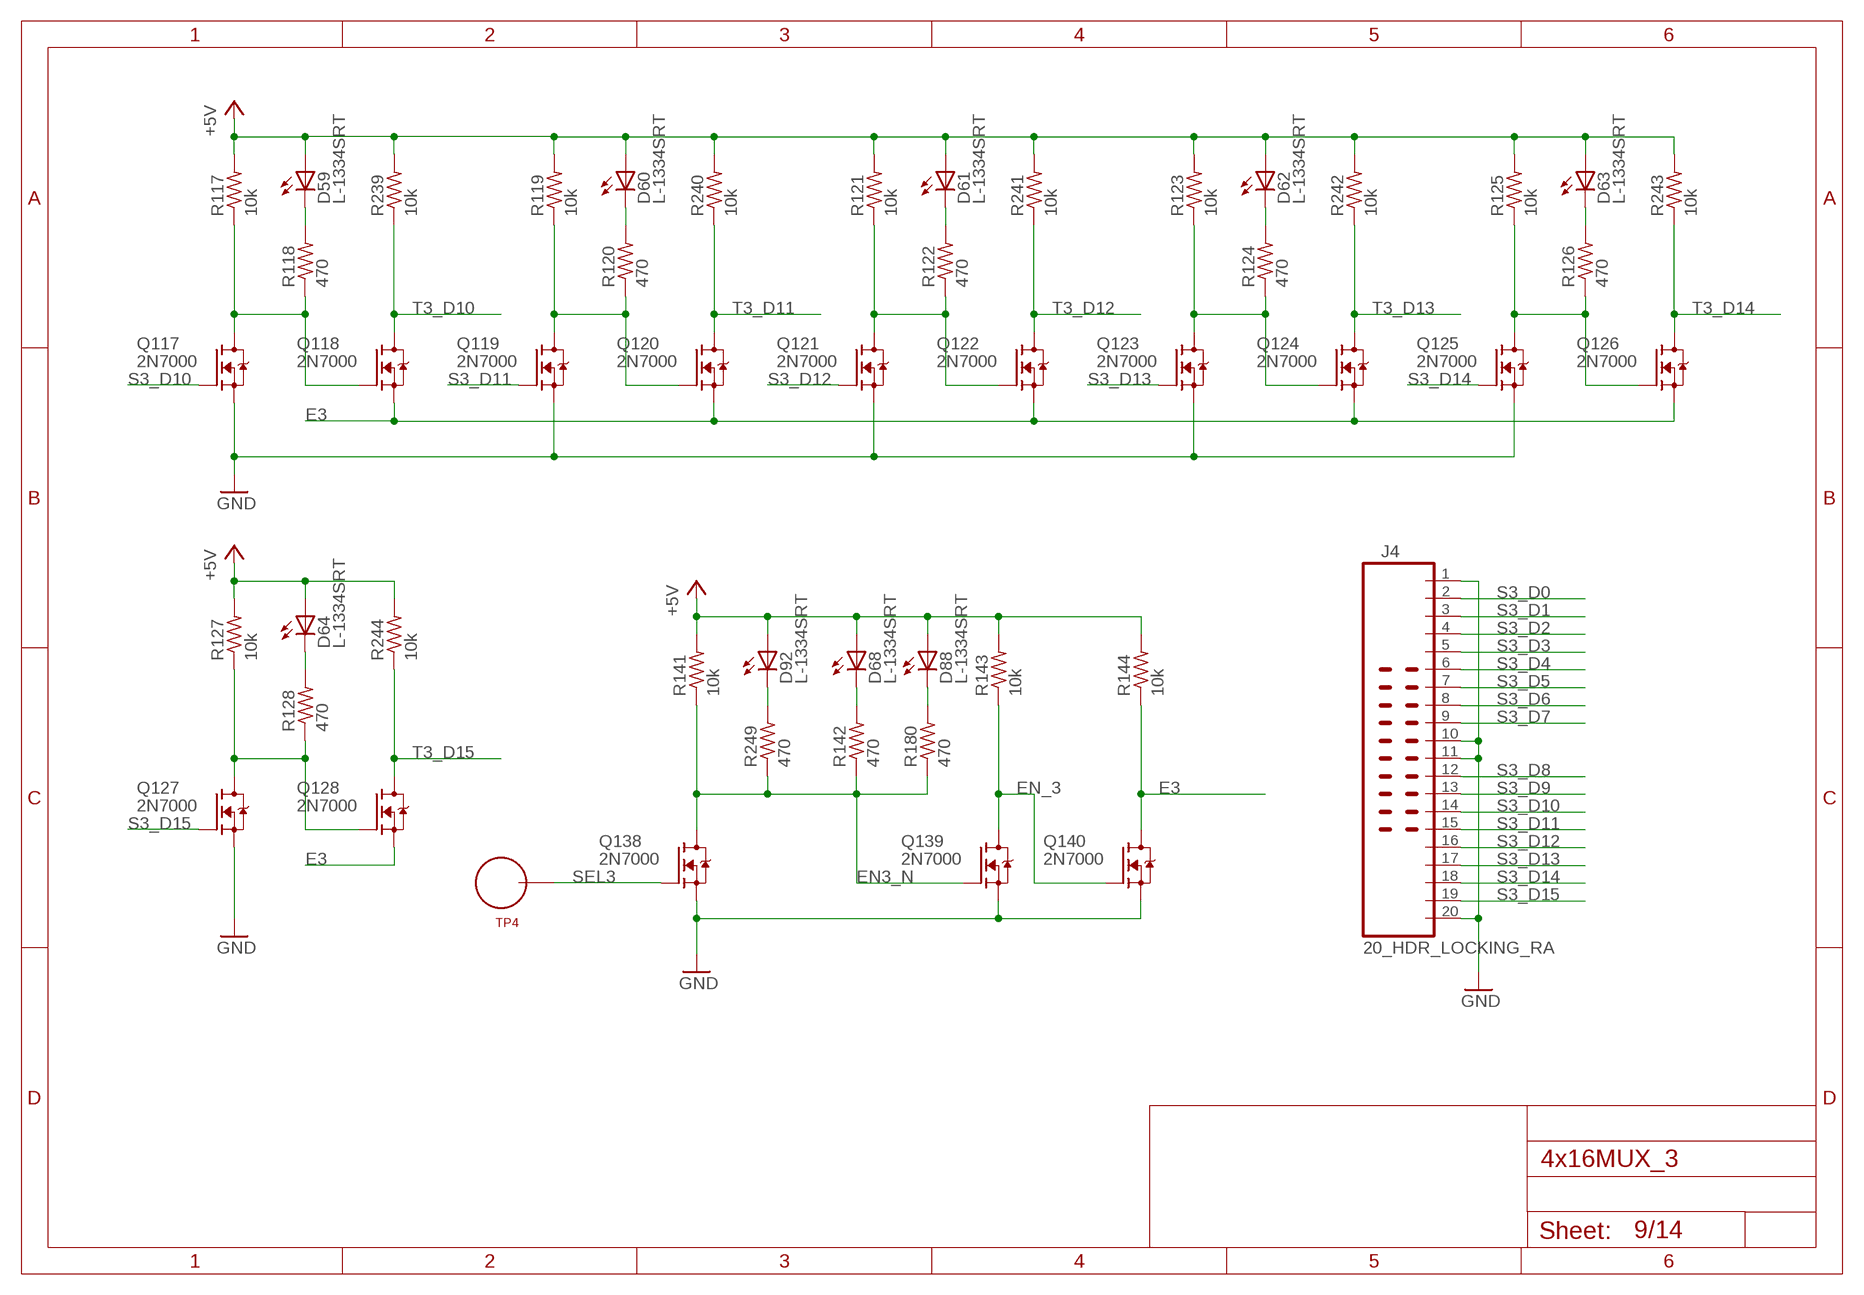
[diagram p8: schematic, sheet 9]

### Parts
D59  L-1334SRT  [LED3MM]
D60  L-1334SRT  [LED3MM]
D61  L-1334SRT  [LED3MM]
D62  L-1334SRT  [LED3MM]
D63  L-1334SRT  [LED3MM]
D64  L-1334SRT  [LED3MM]
D68  L-1334SRT  [LED3MM]
D88  L-1334SRT  [LED3MM]
D92  L-1334SRT  [LED3MM]
J4  20_HDR_LOCKING_RA  [20_HDR_LOCKING_RA]
Q117  2N7000  [TO92-DGS]
Q118  2N7000  [TO92-DGS]
Q119  2N7000  [TO92-DGS]
Q120  2N7000  [TO92-DGS]
Q121  2N7000  [TO92-DGS]
Q122  2N7000  [TO92-DGS]
Q123  2N7000  [TO92-DGS]
Q124  2N7000  [TO92-DGS]
Q125  2N7000  [TO92-DGS]
Q126  2N7000  [TO92-DGS]
Q127  2N7000  [TO92-DGS]
Q128  2N7000  [TO92-DGS]
Q138  2N7000  [TO92-DGS]
Q139  2N7000  [TO92-DGS]
Q140  2N7000  [TO92-DGS]
R117  10k  R_P2INCH  [R_P2INCH]
R118  470  R_P2INCH  [R_P2INCH]
R119  10k  R_P2INCH  [R_P2INCH]
R120  470  R_P2INCH  [R_P2INCH]
R121  10k  R_P2INCH  [R_P2INCH]
R122  470  R_P2INCH  [R_P2INCH]
R123  10k  R_P2INCH  [R_P2INCH]
R124  470  R_P2INCH  [R_P2INCH]
R125  10k  R_P2INCH  [R_P2INCH]
R126  470  R_P2INCH  [R_P2INCH]
R127  10k  R_P2INCH  [R_P2INCH]
R128  470  R_P2INCH  [R_P2INCH]
R141  10k  R_P2INCH  [R_P2INCH]
R142  470  R_P2INCH  [R_P2INCH]
R143  10k  R_P2INCH  [R_P2INCH]
R144  10k  R_P2INCH  [R_P2INCH]
R180  470  R_P2INCH  [R_P2INCH]
R239  10k  R_P2INCH  [R_P2INCH]
R240  10k  R_P2INCH  [R_P2INCH]
R241  10k  R_P2INCH  [R_P2INCH]
R242  10k  R_P2INCH  [R_P2INCH]
R243  10k  R_P2INCH  [R_P2INCH]
R244  10k  R_P2INCH  [R_P2INCH]
R249  470  R_P2INCH  [R_P2INCH]
TP4  TEST_LOOP  [TEST_LOOP]

### Nets
+5V: D59.A D60.A D61.A D62.A D63.A D64.A D68.A D88.A D92.A R117.2 R119.2 R121.2 R123.2 R125.2 R127.2 R141.2 R143.2 R144.2 R239.2 R240.2 R241.2 R242.2 R243.2 R244.2 ; also sheet 1,2,3,4,5,6,7,8,10,11,12,13,14
E3: Q118.S Q120.S Q122.S Q124.S Q126.S Q128.S Q140.D R144.1 ; also sheet 8
EN3_N: Q138.D Q139.G R141.1 R142.1 R180.1 R249.1 ; also sheet 14
EN_3: Q139.D Q140.G R143.1
GND: J4.1 J4.10 J4.11 J4.20 Q117.S Q119.S Q121.S Q123.S Q125.S Q127.S Q138.S Q139.S Q140.S ; also sheet 1,2,3,4,5,6,7,8,10,11,12,13,14
N$117: Q117.D Q118.G R117.1 R118.1
N$118: D59.K(C) R118.2
N$119: Q119.D Q120.G R119.1 R120.1
N$120: D60.K(C) R120.2
N$121: Q121.D Q122.G R121.1 R122.1
N$122: D61.K(C) R122.2
N$123: Q123.D Q124.G R123.1 R124.1
N$124: D62.K(C) R124.2
N$125: Q125.D Q126.G R125.1 R126.1
N$126: D63.K(C) R126.2
N$127: Q127.D Q128.G R127.1 R128.1
N$128: D64.K(C) R128.2
N$132: D68.K(C) R142.2
N$168: D88.K(C) R180.2
N$220: D92.K(C) R249.2
S3_D0: J4.2 ; also sheet 8
S3_D1: J4.3 ; also sheet 8
S3_D2: J4.4 ; also sheet 8
S3_D3: J4.5 ; also sheet 8
S3_D4: J4.6 ; also sheet 8
S3_D5: J4.7 ; also sheet 8
S3_D6: J4.8 ; also sheet 8
S3_D7: J4.9 ; also sheet 8
S3_D8: J4.12 ; also sheet 8
S3_D9: J4.13 ; also sheet 8
S3_D10: J4.14 Q117.G
S3_D11: J4.15 Q119.G
S3_D12: J4.16 Q121.G
S3_D13: J4.17 Q123.G
S3_D14: J4.18 Q125.G
S3_D15: J4.19 Q127.G
SEL3: Q138.G TP4.P$1
T3_D10: Q118.D R239.1 ; also sheet 12
T3_D11: Q120.D R240.1 ; also sheet 12
T3_D12: Q122.D R241.1 ; also sheet 13
T3_D13: Q124.D R242.1 ; also sheet 13
T3_D14: Q126.D R243.1 ; also sheet 13
T3_D15: Q128.D R244.1 ; also sheet 13

## Sheet 10 of 14
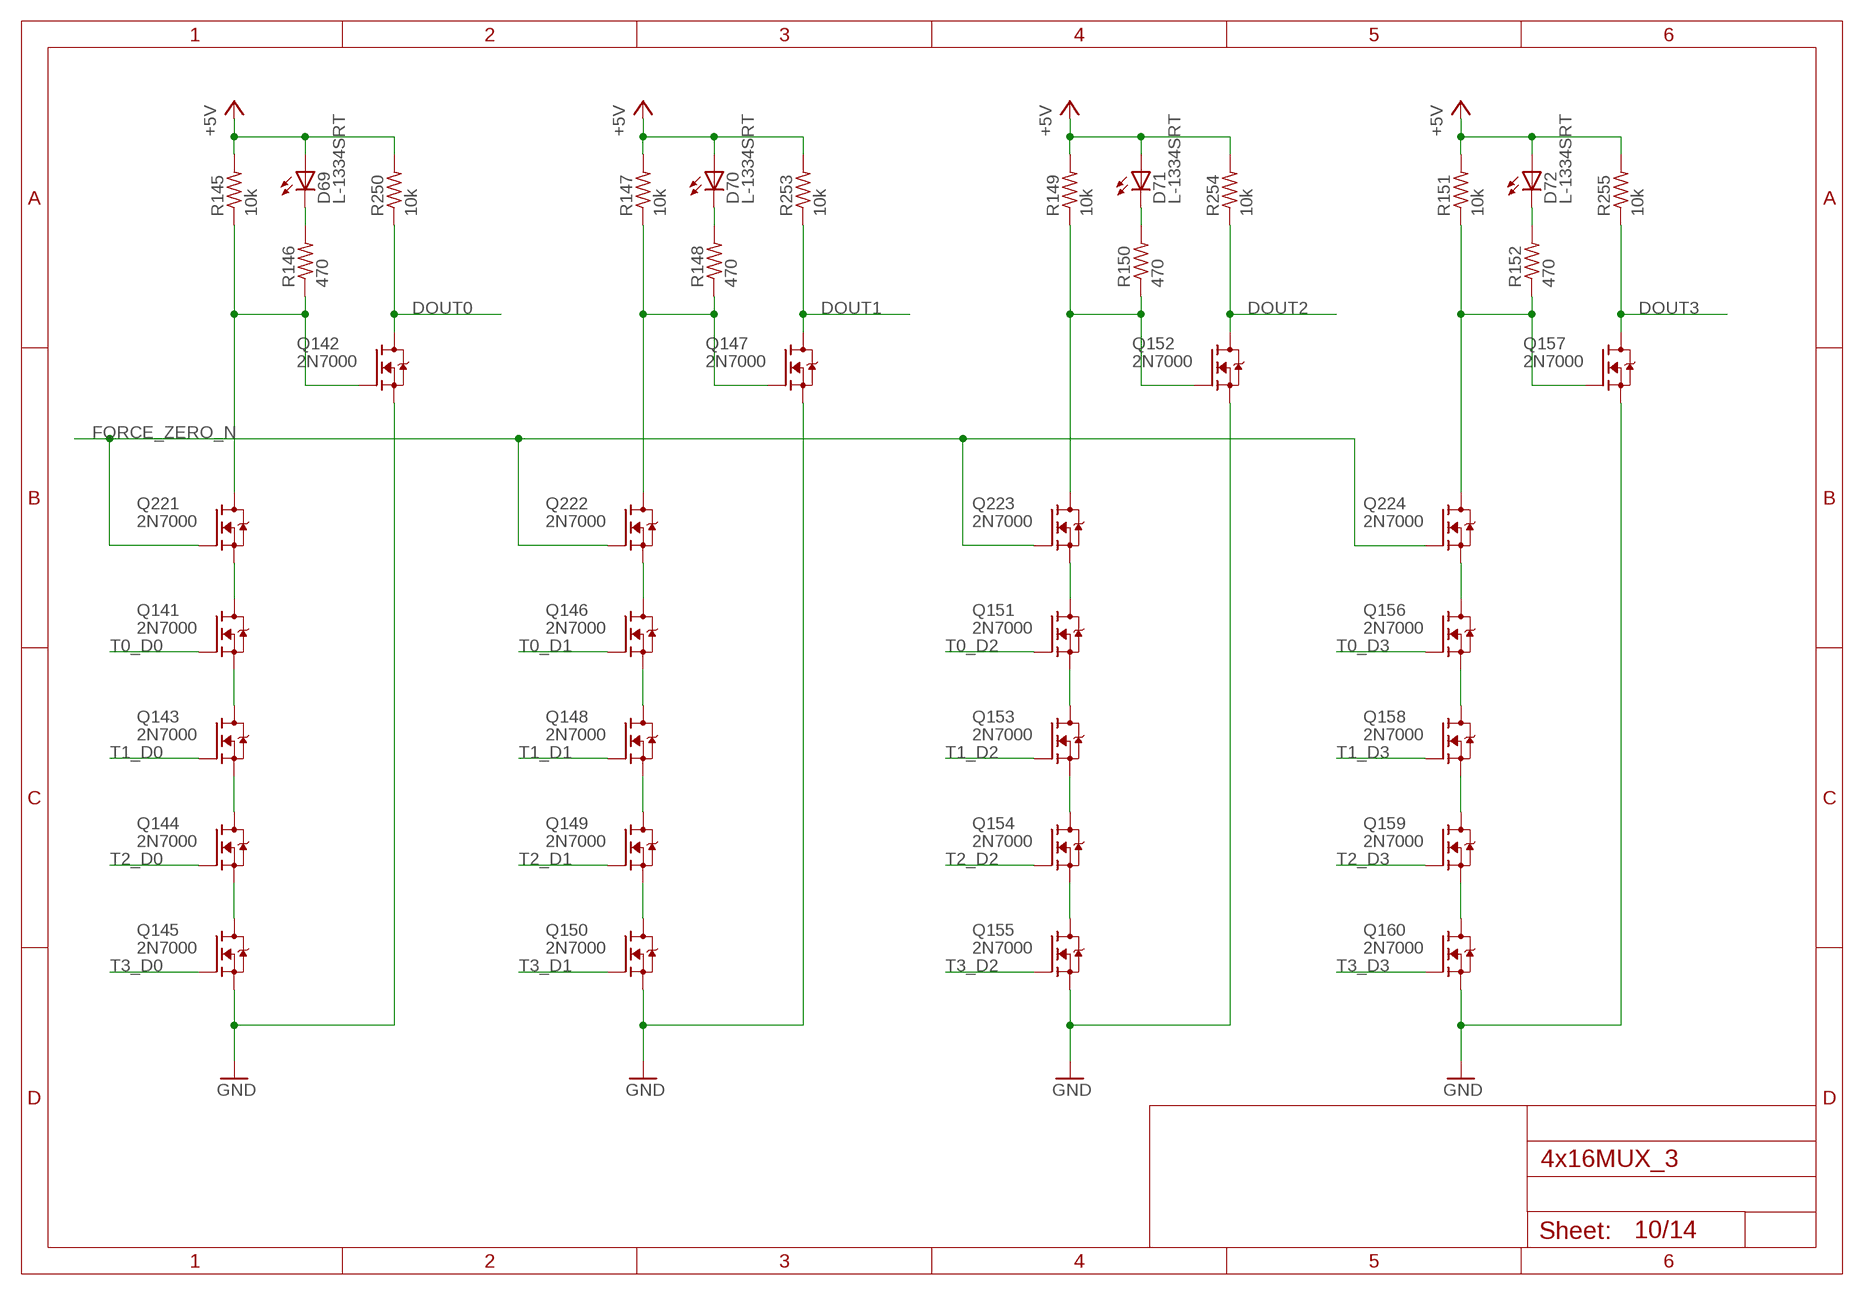
[diagram p9: schematic, sheet 10]

### Parts
D69  L-1334SRT  [LED3MM]
D70  L-1334SRT  [LED3MM]
D71  L-1334SRT  [LED3MM]
D72  L-1334SRT  [LED3MM]
Q141  2N7000  [TO92-DGS]
Q142  2N7000  [TO92-DGS]
Q143  2N7000  [TO92-DGS]
Q144  2N7000  [TO92-DGS]
Q145  2N7000  [TO92-DGS]
Q146  2N7000  [TO92-DGS]
Q147  2N7000  [TO92-DGS]
Q148  2N7000  [TO92-DGS]
Q149  2N7000  [TO92-DGS]
Q150  2N7000  [TO92-DGS]
Q151  2N7000  [TO92-DGS]
Q152  2N7000  [TO92-DGS]
Q153  2N7000  [TO92-DGS]
Q154  2N7000  [TO92-DGS]
Q155  2N7000  [TO92-DGS]
Q156  2N7000  [TO92-DGS]
Q157  2N7000  [TO92-DGS]
Q158  2N7000  [TO92-DGS]
Q159  2N7000  [TO92-DGS]
Q160  2N7000  [TO92-DGS]
Q221  2N7000  [TO92-DGS]
Q222  2N7000  [TO92-DGS]
Q223  2N7000  [TO92-DGS]
Q224  2N7000  [TO92-DGS]
R145  10k  R_P2INCH  [R_P2INCH]
R146  470  R_P2INCH  [R_P2INCH]
R147  10k  R_P2INCH  [R_P2INCH]
R148  470  R_P2INCH  [R_P2INCH]
R149  10k  R_P2INCH  [R_P2INCH]
R150  470  R_P2INCH  [R_P2INCH]
R151  10k  R_P2INCH  [R_P2INCH]
R152  470  R_P2INCH  [R_P2INCH]
R250  10k  R_P2INCH  [R_P2INCH]
R253  10k  R_P2INCH  [R_P2INCH]
R254  10k  R_P2INCH  [R_P2INCH]
R255  10k  R_P2INCH  [R_P2INCH]

### Nets
+5V: D69.A D70.A D71.A D72.A R145.2 R147.2 R149.2 R151.2 R250.2 R253.2 R254.2 R255.2 ; also sheet 1,2,3,4,5,6,7,8,9,11,12,13,14
DOUT0: Q142.D R250.1 ; also sheet 14
DOUT1: Q147.D R253.1 ; also sheet 14
DOUT2: Q152.D R254.1 ; also sheet 14
DOUT3: Q157.D R255.1 ; also sheet 14
FORCE_ZERO_N: Q221.G Q222.G Q223.G Q224.G ; also sheet 11,12,13,14
GND: Q142.S Q145.S Q147.S Q150.S Q152.S Q155.S Q157.S Q160.S ; also sheet 1,2,3,4,5,6,7,8,9,11,12,13,14
N$133: Q142.G Q221.D R145.1 R146.1
N$134: D69.K(C) R146.2
N$135: Q144.S Q145.D
N$136: Q143.S Q144.D
N$137: Q141.S Q143.D
N$138: Q147.G Q222.D R147.1 R148.1
N$139: D70.K(C) R148.2
N$140: Q149.S Q150.D
N$141: Q148.S Q149.D
N$142: Q146.S Q148.D
N$143: Q152.G Q223.D R149.1 R150.1
N$144: D71.K(C) R150.2
N$145: Q154.S Q155.D
N$146: Q153.S Q154.D
N$147: Q151.S Q153.D
N$148: Q157.G Q224.D R151.1 R152.1
N$149: D72.K(C) R152.2
N$150: Q159.S Q160.D
N$151: Q158.S Q159.D
N$152: Q156.S Q158.D
N$226: Q141.D Q221.S
N$227: Q146.D Q222.S
N$228: Q151.D Q223.S
N$229: Q156.D Q224.S
T0_D0: Q141.G ; also sheet 2
T0_D1: Q146.G ; also sheet 2
T0_D2: Q151.G ; also sheet 2
T0_D3: Q156.G ; also sheet 2
T1_D0: Q143.G ; also sheet 4
T1_D1: Q148.G ; also sheet 4
T1_D2: Q153.G ; also sheet 4
T1_D3: Q158.G ; also sheet 4
T2_D0: Q144.G ; also sheet 6
T2_D1: Q149.G ; also sheet 6
T2_D2: Q154.G ; also sheet 6
T2_D3: Q159.G ; also sheet 6
T3_D0: Q145.G ; also sheet 8
T3_D1: Q150.G ; also sheet 8
T3_D2: Q155.G ; also sheet 8
T3_D3: Q160.G ; also sheet 8

## Sheet 11 of 14
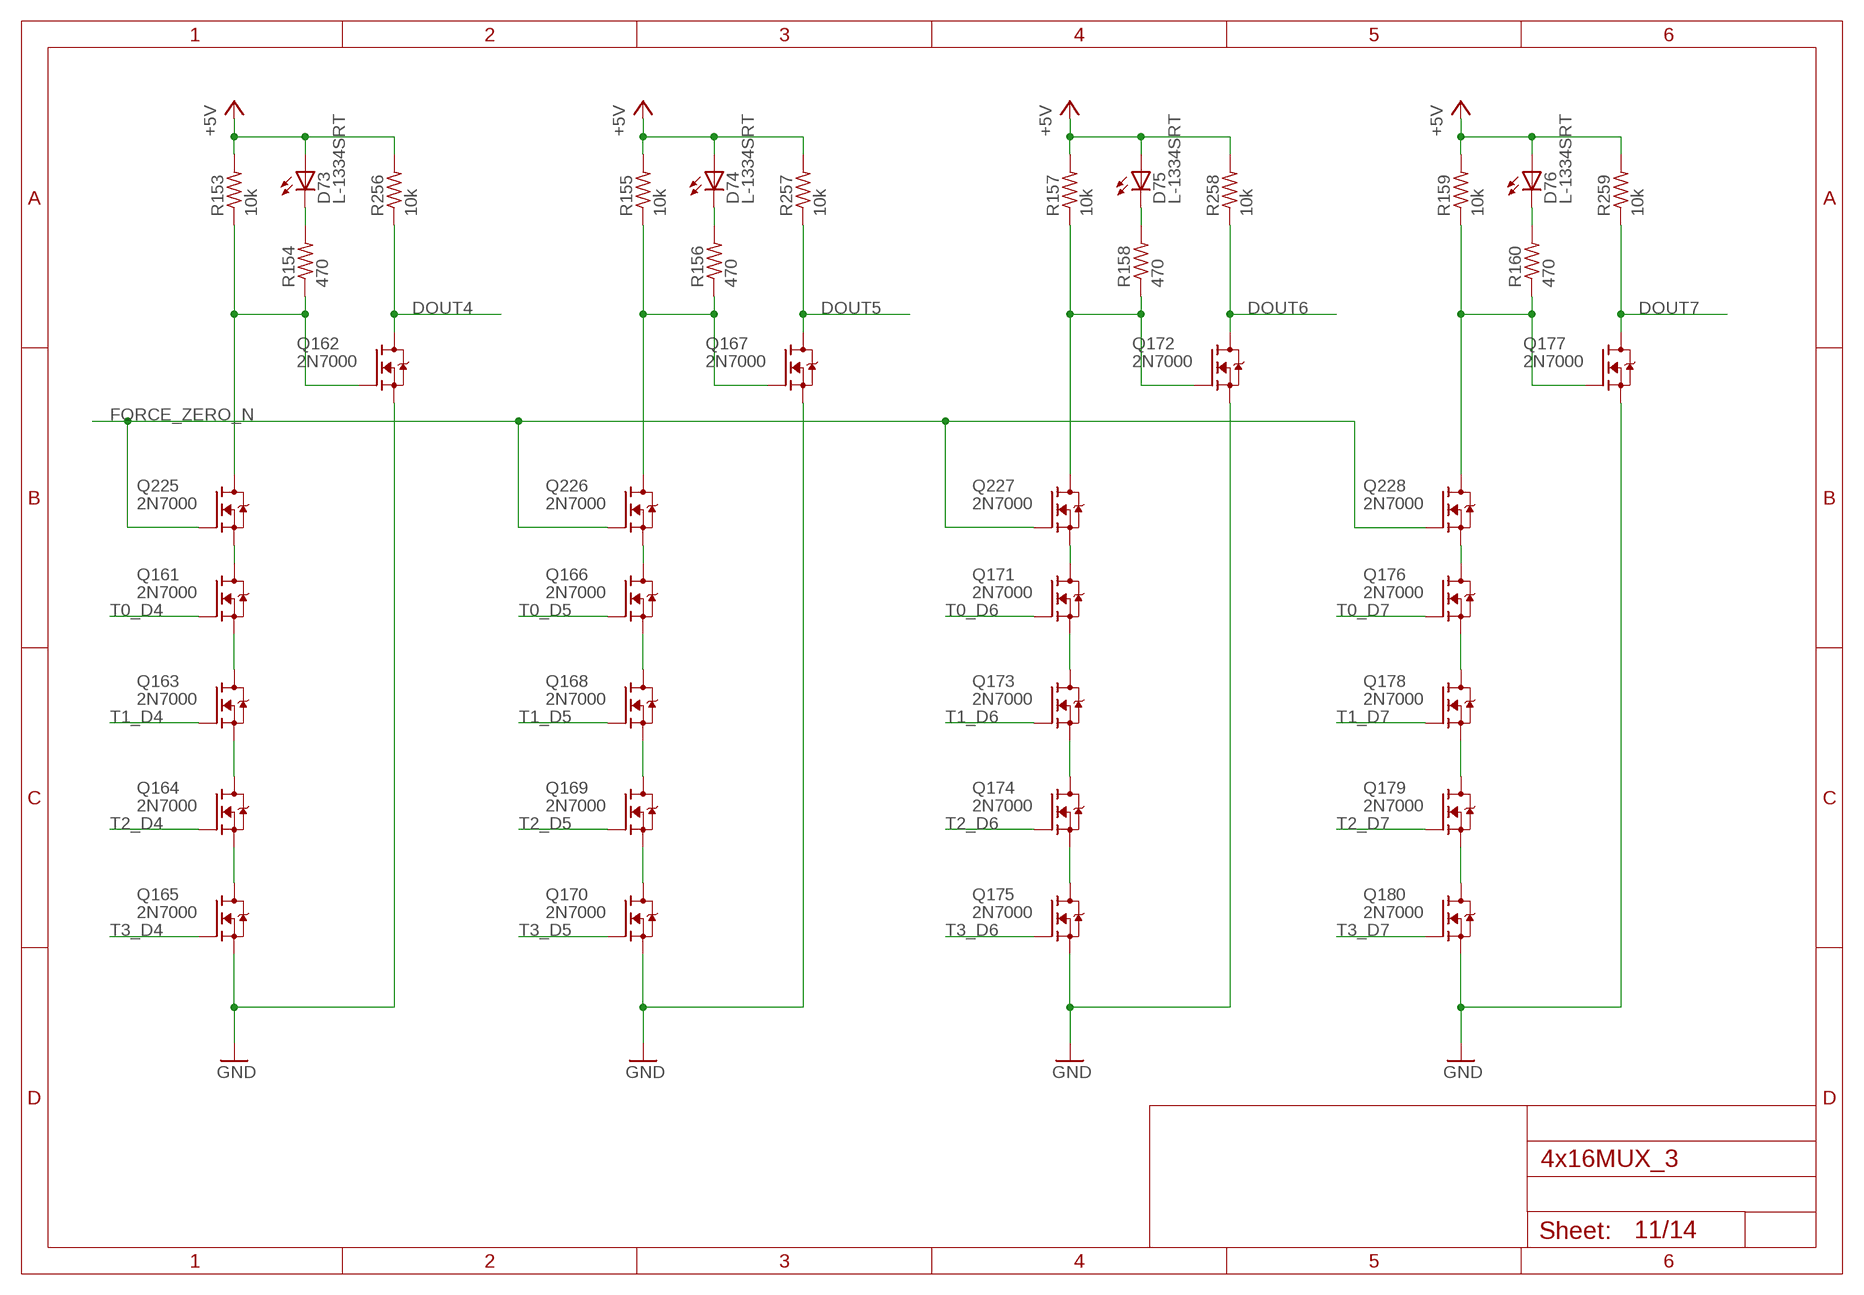
[diagram p10: schematic, sheet 11]

### Parts
D73  L-1334SRT  [LED3MM]
D74  L-1334SRT  [LED3MM]
D75  L-1334SRT  [LED3MM]
D76  L-1334SRT  [LED3MM]
Q161  2N7000  [TO92-DGS]
Q162  2N7000  [TO92-DGS]
Q163  2N7000  [TO92-DGS]
Q164  2N7000  [TO92-DGS]
Q165  2N7000  [TO92-DGS]
Q166  2N7000  [TO92-DGS]
Q167  2N7000  [TO92-DGS]
Q168  2N7000  [TO92-DGS]
Q169  2N7000  [TO92-DGS]
Q170  2N7000  [TO92-DGS]
Q171  2N7000  [TO92-DGS]
Q172  2N7000  [TO92-DGS]
Q173  2N7000  [TO92-DGS]
Q174  2N7000  [TO92-DGS]
Q175  2N7000  [TO92-DGS]
Q176  2N7000  [TO92-DGS]
Q177  2N7000  [TO92-DGS]
Q178  2N7000  [TO92-DGS]
Q179  2N7000  [TO92-DGS]
Q180  2N7000  [TO92-DGS]
Q225  2N7000  [TO92-DGS]
Q226  2N7000  [TO92-DGS]
Q227  2N7000  [TO92-DGS]
Q228  2N7000  [TO92-DGS]
R153  10k  R_P2INCH  [R_P2INCH]
R154  470  R_P2INCH  [R_P2INCH]
R155  10k  R_P2INCH  [R_P2INCH]
R156  470  R_P2INCH  [R_P2INCH]
R157  10k  R_P2INCH  [R_P2INCH]
R158  470  R_P2INCH  [R_P2INCH]
R159  10k  R_P2INCH  [R_P2INCH]
R160  470  R_P2INCH  [R_P2INCH]
R256  10k  R_P2INCH  [R_P2INCH]
R257  10k  R_P2INCH  [R_P2INCH]
R258  10k  R_P2INCH  [R_P2INCH]
R259  10k  R_P2INCH  [R_P2INCH]

### Nets
+5V: D73.A D74.A D75.A D76.A R153.2 R155.2 R157.2 R159.2 R256.2 R257.2 R258.2 R259.2 ; also sheet 1,2,3,4,5,6,7,8,9,10,12,13,14
DOUT4: Q162.D R256.1 ; also sheet 14
DOUT5: Q167.D R257.1 ; also sheet 14
DOUT6: Q172.D R258.1 ; also sheet 14
DOUT7: Q177.D R259.1 ; also sheet 14
FORCE_ZERO_N: Q225.G Q226.G Q227.G Q228.G ; also sheet 10,12,13,14
GND: Q162.S Q165.S Q167.S Q170.S Q172.S Q175.S Q177.S Q180.S ; also sheet 1,2,3,4,5,6,7,8,9,10,12,13,14
N$153: Q162.G Q225.D R153.1 R154.1
N$154: D73.K(C) R154.2
N$155: Q164.S Q165.D
N$156: Q163.S Q164.D
N$157: Q161.S Q163.D
N$158: Q167.G Q226.D R155.1 R156.1
N$159: D74.K(C) R156.2
N$160: Q169.S Q170.D
N$161: Q168.S Q169.D
N$162: Q166.S Q168.D
N$163: Q172.G Q227.D R157.1 R158.1
N$164: D75.K(C) R158.2
N$169: Q174.S Q175.D
N$170: Q173.S Q174.D
N$171: Q171.S Q173.D
N$172: Q177.G Q228.D R159.1 R160.1
N$173: D76.K(C) R160.2
N$174: Q179.S Q180.D
N$175: Q178.S Q179.D
N$176: Q176.S Q178.D
N$225: Q161.D Q225.S
N$231: Q166.D Q226.S
N$232: Q171.D Q227.S
N$233: Q176.D Q228.S
T0_D4: Q161.G ; also sheet 2
T0_D5: Q166.G ; also sheet 2
T0_D6: Q171.G ; also sheet 2
T0_D7: Q176.G ; also sheet 2
T1_D4: Q163.G ; also sheet 4
T1_D5: Q168.G ; also sheet 4
T1_D6: Q173.G ; also sheet 4
T1_D7: Q178.G ; also sheet 4
T2_D4: Q164.G ; also sheet 6
T2_D5: Q169.G ; also sheet 6
T2_D6: Q174.G ; also sheet 6
T2_D7: Q179.G ; also sheet 6
T3_D4: Q165.G ; also sheet 8
T3_D5: Q170.G ; also sheet 8
T3_D6: Q175.G ; also sheet 8
T3_D7: Q180.G ; also sheet 8

## Sheet 12 of 14
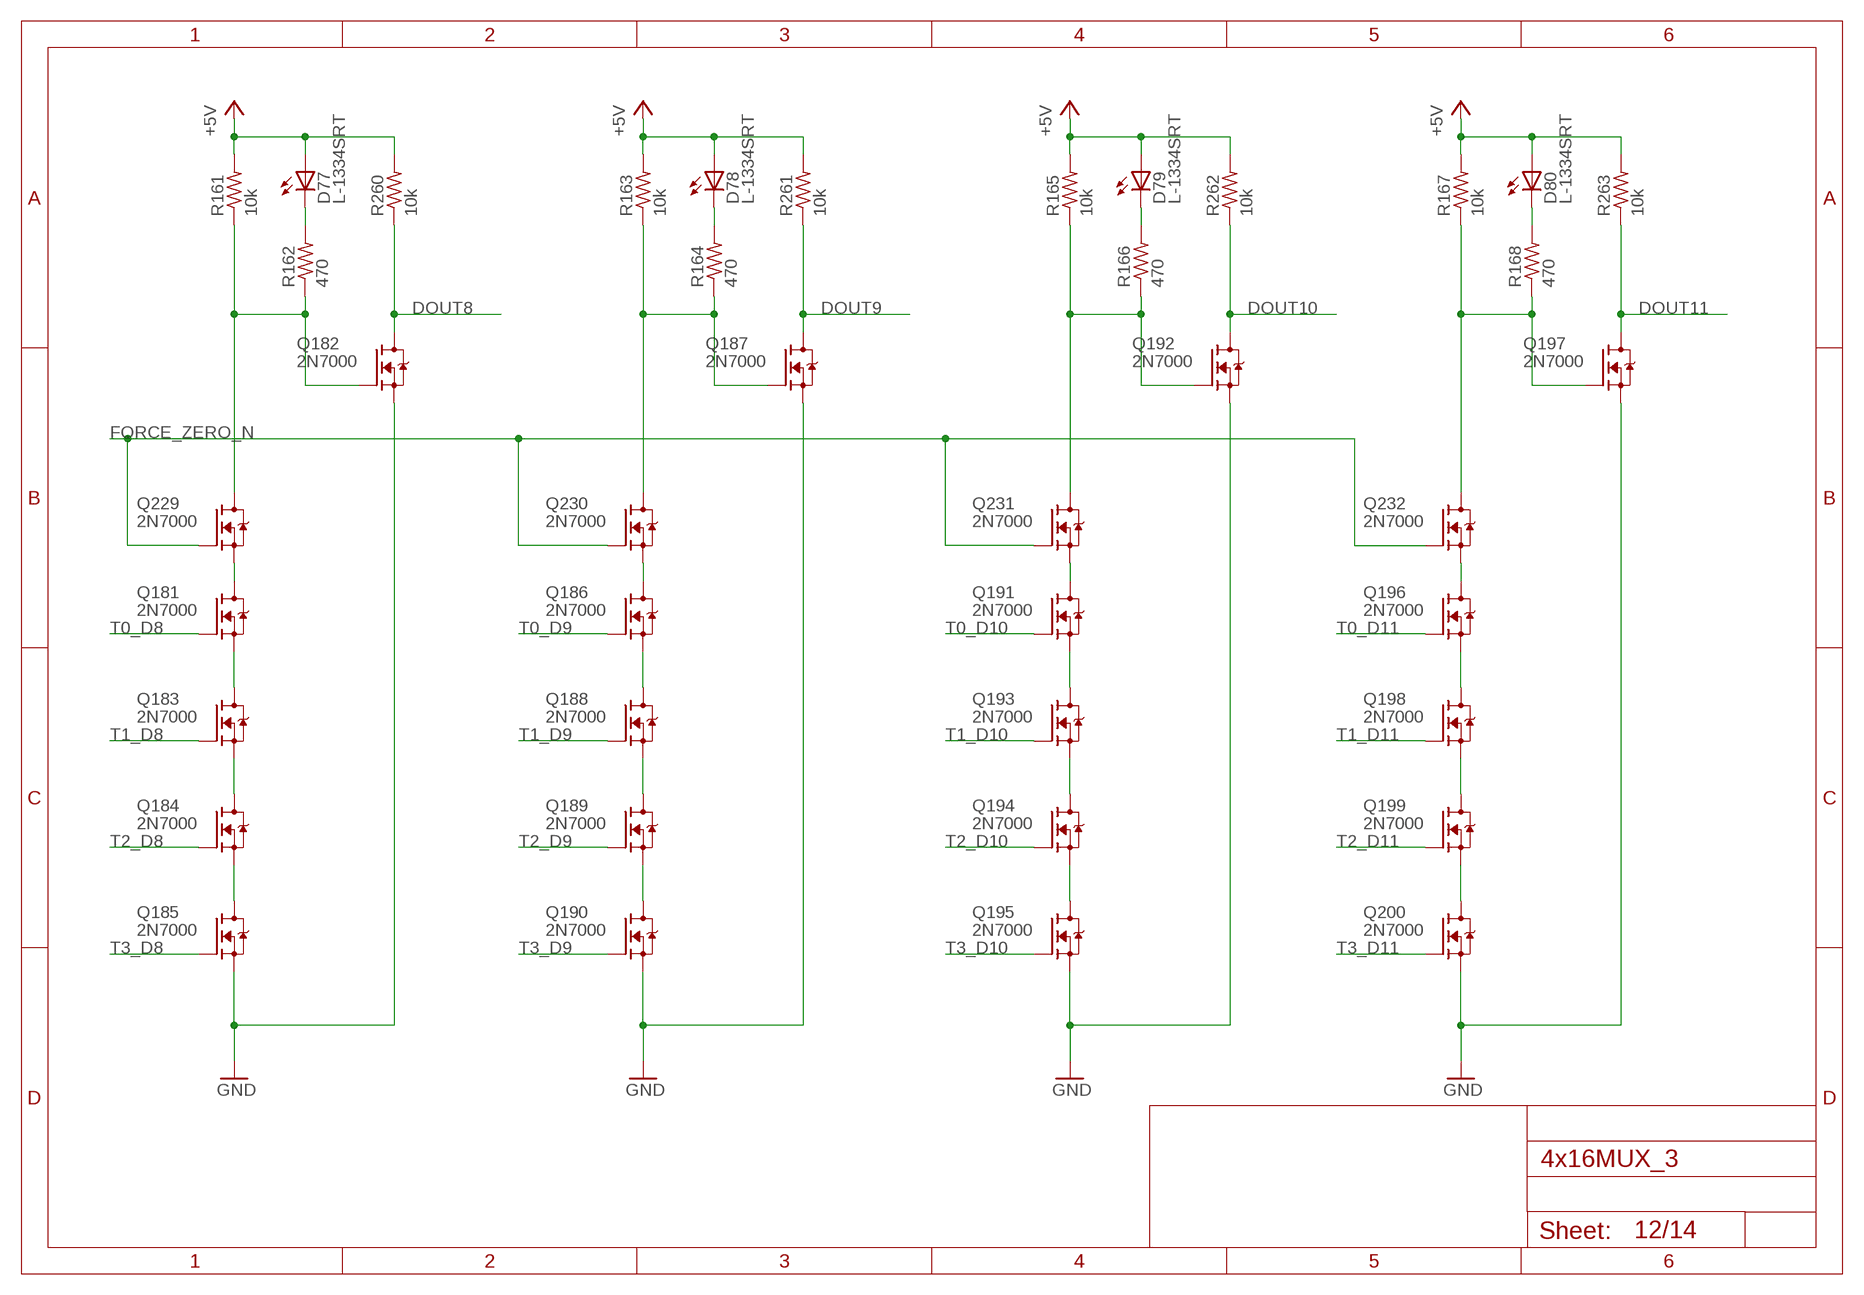
[diagram p11: schematic, sheet 12]

### Parts
D77  L-1334SRT  [LED3MM]
D78  L-1334SRT  [LED3MM]
D79  L-1334SRT  [LED3MM]
D80  L-1334SRT  [LED3MM]
Q181  2N7000  [TO92-DGS]
Q182  2N7000  [TO92-DGS]
Q183  2N7000  [TO92-DGS]
Q184  2N7000  [TO92-DGS]
Q185  2N7000  [TO92-DGS]
Q186  2N7000  [TO92-DGS]
Q187  2N7000  [TO92-DGS]
Q188  2N7000  [TO92-DGS]
Q189  2N7000  [TO92-DGS]
Q190  2N7000  [TO92-DGS]
Q191  2N7000  [TO92-DGS]
Q192  2N7000  [TO92-DGS]
Q193  2N7000  [TO92-DGS]
Q194  2N7000  [TO92-DGS]
Q195  2N7000  [TO92-DGS]
Q196  2N7000  [TO92-DGS]
Q197  2N7000  [TO92-DGS]
Q198  2N7000  [TO92-DGS]
Q199  2N7000  [TO92-DGS]
Q200  2N7000  [TO92-DGS]
Q229  2N7000  [TO92-DGS]
Q230  2N7000  [TO92-DGS]
Q231  2N7000  [TO92-DGS]
Q232  2N7000  [TO92-DGS]
R161  10k  R_P2INCH  [R_P2INCH]
R162  470  R_P2INCH  [R_P2INCH]
R163  10k  R_P2INCH  [R_P2INCH]
R164  470  R_P2INCH  [R_P2INCH]
R165  10k  R_P2INCH  [R_P2INCH]
R166  470  R_P2INCH  [R_P2INCH]
R167  10k  R_P2INCH  [R_P2INCH]
R168  470  R_P2INCH  [R_P2INCH]
R260  10k  R_P2INCH  [R_P2INCH]
R261  10k  R_P2INCH  [R_P2INCH]
R262  10k  R_P2INCH  [R_P2INCH]
R263  10k  R_P2INCH  [R_P2INCH]

### Nets
+5V: D77.A D78.A D79.A D80.A R161.2 R163.2 R165.2 R167.2 R260.2 R261.2 R262.2 R263.2 ; also sheet 1,2,3,4,5,6,7,8,9,10,11,13,14
DOUT8: Q182.D R260.1 ; also sheet 14
DOUT9: Q187.D R261.1 ; also sheet 14
DOUT10: Q192.D R262.1 ; also sheet 14
DOUT11: Q197.D R263.1 ; also sheet 14
FORCE_ZERO_N: Q229.G Q230.G Q231.G Q232.G ; also sheet 10,11,13,14
GND: Q182.S Q185.S Q187.S Q190.S Q192.S Q195.S Q197.S Q200.S ; also sheet 1,2,3,4,5,6,7,8,9,10,11,13,14
N$177: Q182.G Q229.D R161.1 R162.1
N$178: D77.K(C) R162.2
N$179: Q184.S Q185.D
N$180: Q183.S Q184.D
N$181: Q181.S Q183.D
N$182: Q187.G Q230.D R163.1 R164.1
N$183: D78.K(C) R164.2
N$184: Q189.S Q190.D
N$185: Q188.S Q189.D
N$186: Q186.S Q188.D
N$187: Q192.G Q231.D R165.1 R166.1
N$188: D79.K(C) R166.2
N$189: Q194.S Q195.D
N$190: Q193.S Q194.D
N$191: Q191.S Q193.D
N$192: Q197.G Q232.D R167.1 R168.1
N$193: D80.K(C) R168.2
N$194: Q199.S Q200.D
N$195: Q198.S Q199.D
N$196: Q196.S Q198.D
N$234: Q181.D Q229.S
N$235: Q186.D Q230.S
N$236: Q191.D Q231.S
N$237: Q196.D Q232.S
T0_D8: Q181.G ; also sheet 2
T0_D9: Q186.G ; also sheet 2
T0_D10: Q191.G ; also sheet 3
T0_D11: Q196.G ; also sheet 3
T1_D8: Q183.G ; also sheet 4
T1_D9: Q188.G ; also sheet 4
T1_D10: Q193.G ; also sheet 5
T1_D11: Q198.G ; also sheet 5
T2_D8: Q184.G ; also sheet 6
T2_D9: Q189.G ; also sheet 6
T2_D10: Q194.G ; also sheet 7
T2_D11: Q199.G ; also sheet 7
T3_D8: Q185.G ; also sheet 8
T3_D9: Q190.G ; also sheet 8
T3_D10: Q195.G ; also sheet 9
T3_D11: Q200.G ; also sheet 9

## Sheet 13 of 14
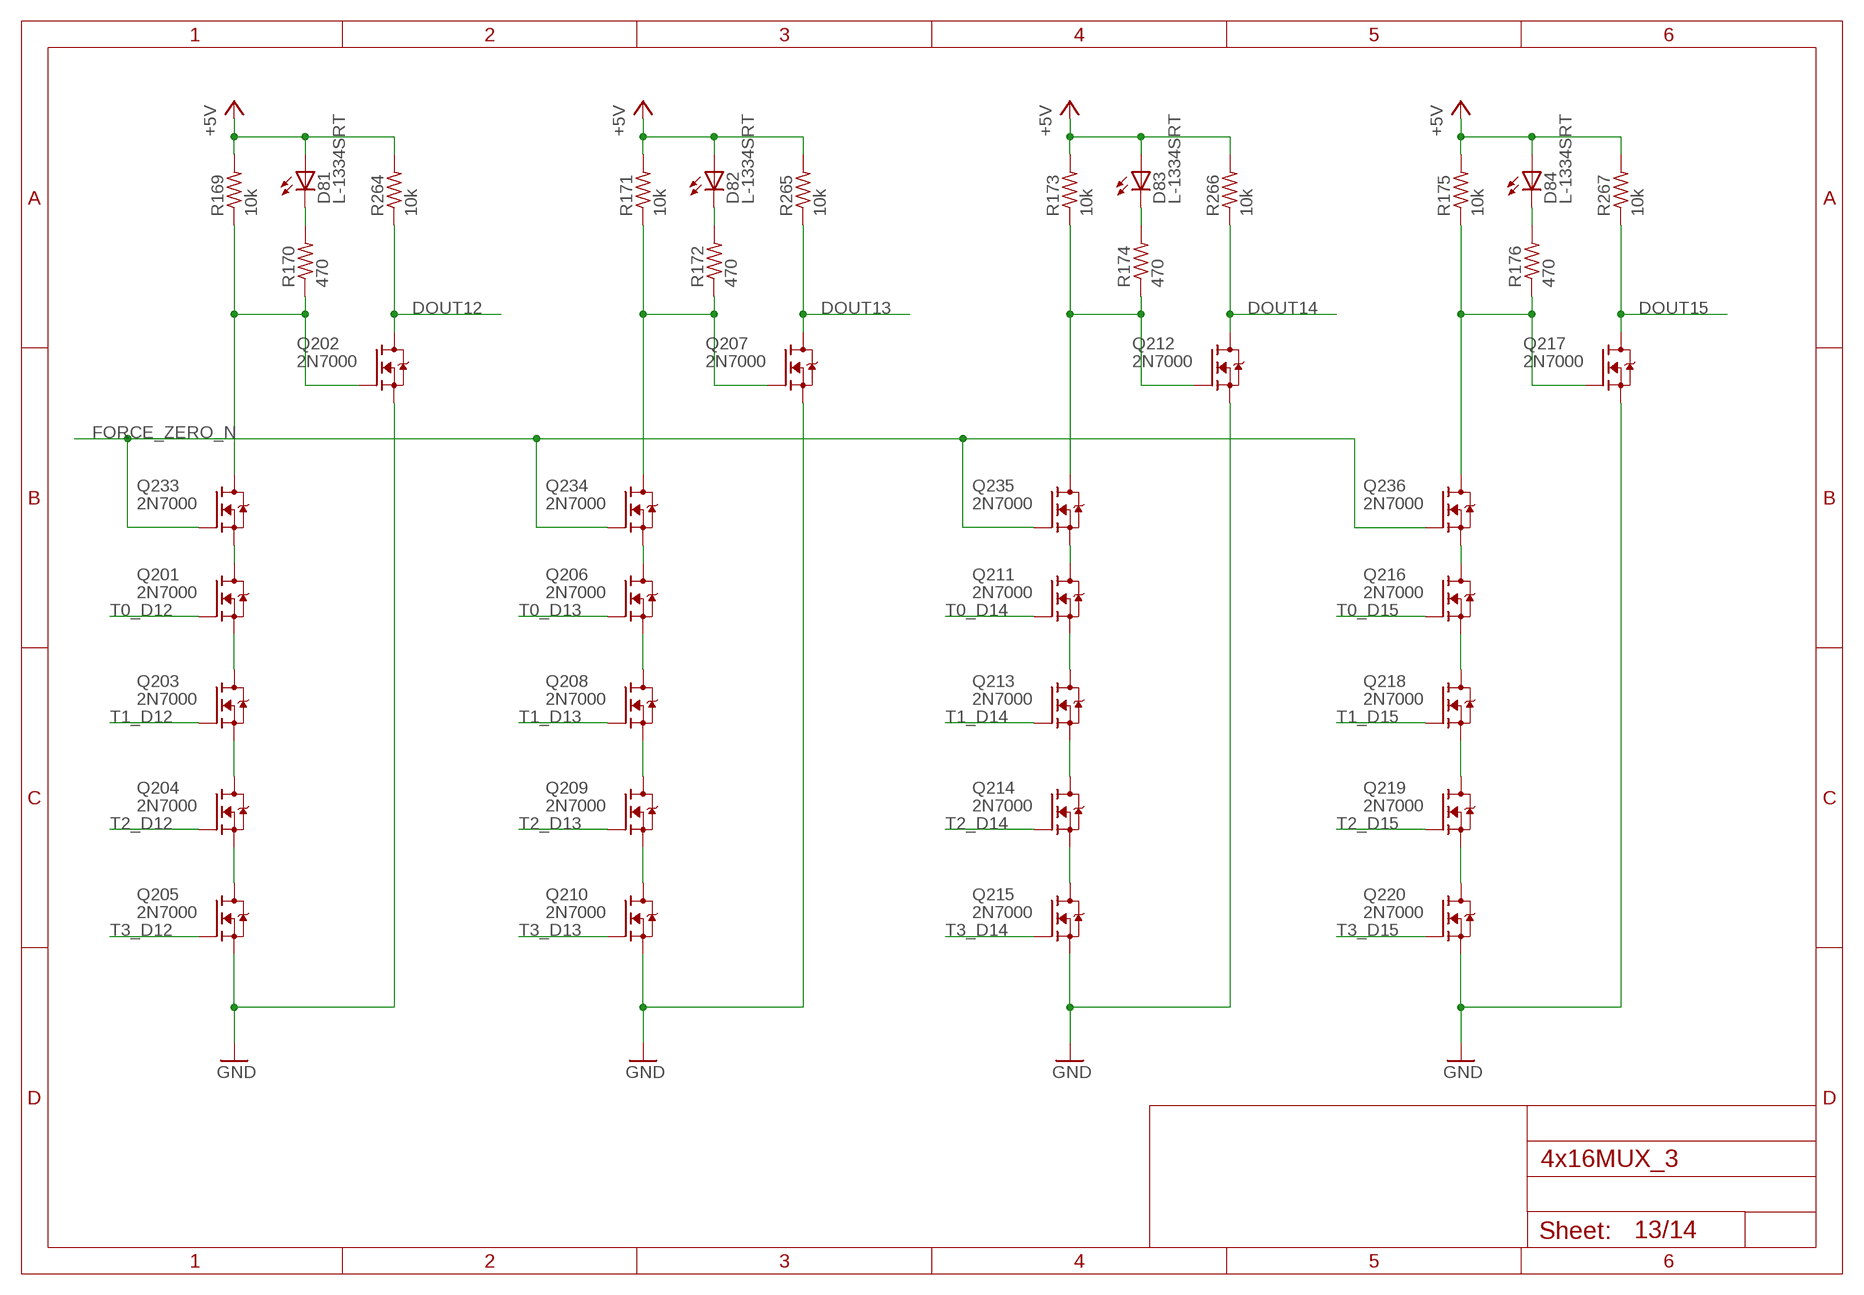
[diagram p12: schematic, sheet 13]

### Parts
D81  L-1334SRT  [LED3MM]
D82  L-1334SRT  [LED3MM]
D83  L-1334SRT  [LED3MM]
D84  L-1334SRT  [LED3MM]
Q201  2N7000  [TO92-DGS]
Q202  2N7000  [TO92-DGS]
Q203  2N7000  [TO92-DGS]
Q204  2N7000  [TO92-DGS]
Q205  2N7000  [TO92-DGS]
Q206  2N7000  [TO92-DGS]
Q207  2N7000  [TO92-DGS]
Q208  2N7000  [TO92-DGS]
Q209  2N7000  [TO92-DGS]
Q210  2N7000  [TO92-DGS]
Q211  2N7000  [TO92-DGS]
Q212  2N7000  [TO92-DGS]
Q213  2N7000  [TO92-DGS]
Q214  2N7000  [TO92-DGS]
Q215  2N7000  [TO92-DGS]
Q216  2N7000  [TO92-DGS]
Q217  2N7000  [TO92-DGS]
Q218  2N7000  [TO92-DGS]
Q219  2N7000  [TO92-DGS]
Q220  2N7000  [TO92-DGS]
Q233  2N7000  [TO92-DGS]
Q234  2N7000  [TO92-DGS]
Q235  2N7000  [TO92-DGS]
Q236  2N7000  [TO92-DGS]
R169  10k  R_P2INCH  [R_P2INCH]
R170  470  R_P2INCH  [R_P2INCH]
R171  10k  R_P2INCH  [R_P2INCH]
R172  470  R_P2INCH  [R_P2INCH]
R173  10k  R_P2INCH  [R_P2INCH]
R174  470  R_P2INCH  [R_P2INCH]
R175  10k  R_P2INCH  [R_P2INCH]
R176  470  R_P2INCH  [R_P2INCH]
R264  10k  R_P2INCH  [R_P2INCH]
R265  10k  R_P2INCH  [R_P2INCH]
R266  10k  R_P2INCH  [R_P2INCH]
R267  10k  R_P2INCH  [R_P2INCH]

### Nets
+5V: D81.A D82.A D83.A D84.A R169.2 R171.2 R173.2 R175.2 R264.2 R265.2 R266.2 R267.2 ; also sheet 1,2,3,4,5,6,7,8,9,10,11,12,14
DOUT12: Q202.D R264.1 ; also sheet 14
DOUT13: Q207.D R265.1 ; also sheet 14
DOUT14: Q212.D R266.1 ; also sheet 14
DOUT15: Q217.D R267.1 ; also sheet 14
FORCE_ZERO_N: Q233.G Q234.G Q235.G Q236.G ; also sheet 10,11,12,14
GND: Q202.S Q205.S Q207.S Q210.S Q212.S Q215.S Q217.S Q220.S ; also sheet 1,2,3,4,5,6,7,8,9,10,11,12,14
N$197: Q202.G Q233.D R169.1 R170.1
N$198: D81.K(C) R170.2
N$199: Q204.S Q205.D
N$200: Q203.S Q204.D
N$201: Q201.S Q203.D
N$202: Q207.G Q234.D R171.1 R172.1
N$203: D82.K(C) R172.2
N$204: Q209.S Q210.D
N$205: Q208.S Q209.D
N$206: Q206.S Q208.D
N$207: Q212.G Q235.D R173.1 R174.1
N$208: D83.K(C) R174.2
N$209: Q214.S Q215.D
N$210: Q213.S Q214.D
N$211: Q211.S Q213.D
N$212: Q217.G Q236.D R175.1 R176.1
N$213: D84.K(C) R176.2
N$214: Q219.S Q220.D
N$215: Q218.S Q219.D
N$216: Q216.S Q218.D
N$238: Q201.D Q233.S
N$239: Q206.D Q234.S
N$240: Q211.D Q235.S
N$241: Q216.D Q236.S
T0_D12: Q201.G ; also sheet 3
T0_D13: Q206.G ; also sheet 3
T0_D14: Q211.G ; also sheet 3
T0_D15: Q216.G ; also sheet 3
T1_D12: Q203.G ; also sheet 5
T1_D13: Q208.G ; also sheet 5
T1_D14: Q213.G ; also sheet 5
T1_D15: Q218.G ; also sheet 5
T2_D12: Q204.G ; also sheet 7
T2_D13: Q209.G ; also sheet 7
T2_D14: Q214.G ; also sheet 7
T2_D15: Q219.G ; also sheet 7
T3_D12: Q205.G ; also sheet 9
T3_D13: Q210.G ; also sheet 9
T3_D14: Q215.G ; also sheet 9
T3_D15: Q220.G ; also sheet 9

## Sheet 14 of 14
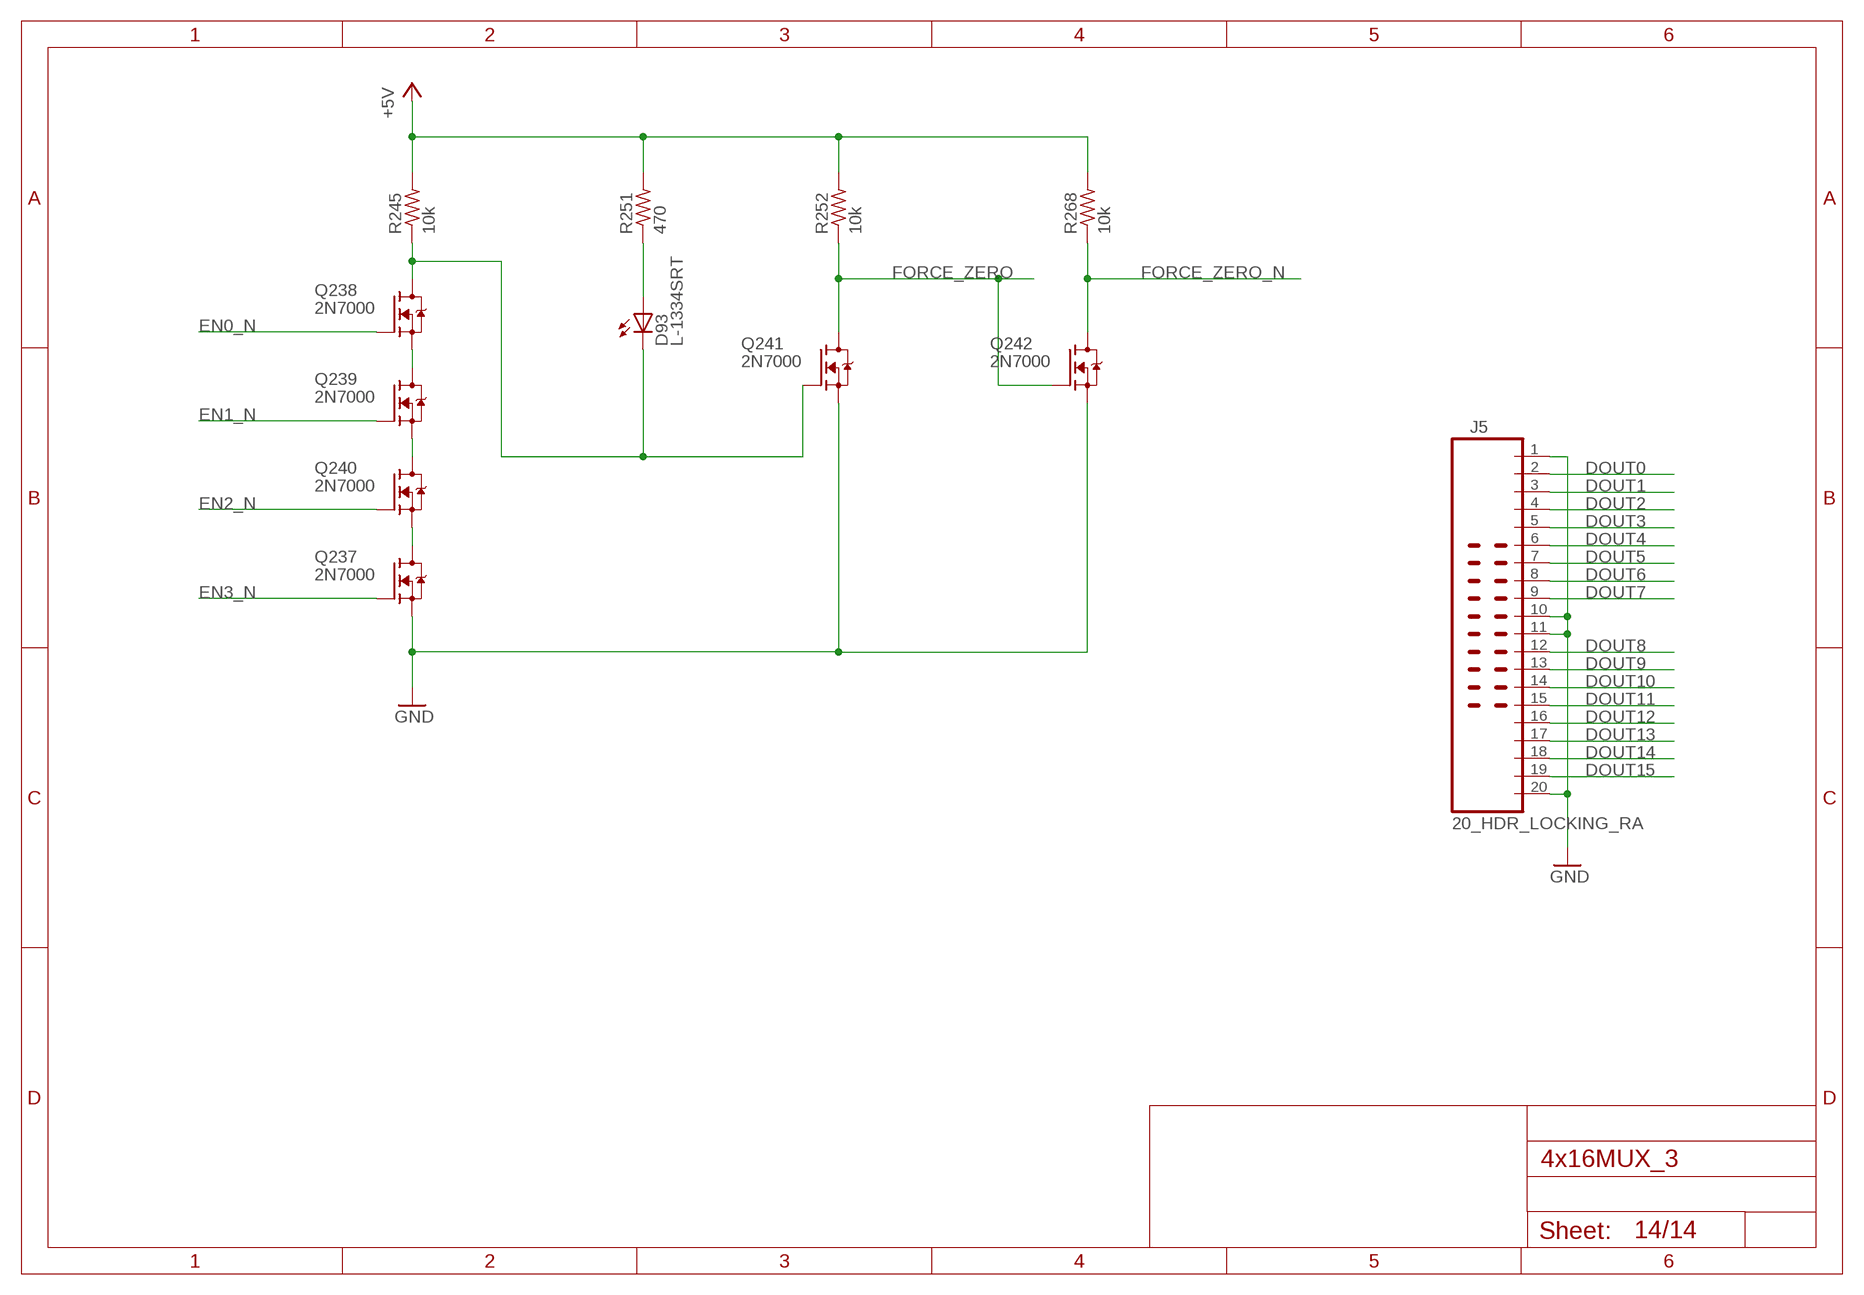
[diagram p13: schematic, sheet 14]

### Parts
D93  L-1334SRT  [LED3MM]
J5  20_HDR_LOCKING_RA  [20_HDR_LOCKING_RA]
Q237  2N7000  [TO92-DGS]
Q238  2N7000  [TO92-DGS]
Q239  2N7000  [TO92-DGS]
Q240  2N7000  [TO92-DGS]
Q241  2N7000  [TO92-DGS]
Q242  2N7000  [TO92-DGS]
R245  10k  R_P2INCH  [R_P2INCH]
R251  470  R_P2INCH  [R_P2INCH]
R252  10k  R_P2INCH  [R_P2INCH]
R268  10k  R_P2INCH  [R_P2INCH]

### Nets
+5V: R245.2 R251.2 R252.2 R268.2 ; also sheet 1,2,3,4,5,6,7,8,9,10,11,12,13
DOUT0: J5.2 ; also sheet 10
DOUT1: J5.3 ; also sheet 10
DOUT2: J5.4 ; also sheet 10
DOUT3: J5.5 ; also sheet 10
DOUT4: J5.6 ; also sheet 11
DOUT5: J5.7 ; also sheet 11
DOUT6: J5.8 ; also sheet 11
DOUT7: J5.9 ; also sheet 11
DOUT8: J5.12 ; also sheet 12
DOUT9: J5.13 ; also sheet 12
DOUT10: J5.14 ; also sheet 12
DOUT11: J5.15 ; also sheet 12
DOUT12: J5.16 ; also sheet 13
DOUT13: J5.17 ; also sheet 13
DOUT14: J5.18 ; also sheet 13
DOUT15: J5.19 ; also sheet 13
EN0_N: Q238.G ; also sheet 3
EN1_N: Q239.G ; also sheet 5
EN2_N: Q240.G ; also sheet 7
EN3_N: Q237.G ; also sheet 9
FORCE_ZERO: Q241.D Q242.G R252.1
FORCE_ZERO_N: Q242.D R268.1 ; also sheet 10,11,12,13
GND: J5.1 J5.10 J5.11 J5.20 Q237.S Q241.S Q242.S ; also sheet 1,2,3,4,5,6,7,8,9,10,11,12,13
N$221: D93.K(C) Q238.D Q241.G R245.1
N$222: Q238.S Q239.D
N$223: Q239.S Q240.D
N$224: Q237.D Q240.S
N$230: D93.A R251.1

## Library data of the parts
C1-C6 C8 = MyLib:C_P2INCH
C7 = MyLib:POLARISED_CAP_2P5_6P3MM
D1-D93 = MyLib:L-1334SRT
H1-H8 = MyLib:3M_MOUNT_HOLE
J1-J5 = MyLib:20_HDR_LOCKING_RA
Q1-Q242 = MyLib:2N7000
R1-R268 = MyLib:R_P2INCH
TP1-TP6 = MyLib:TEST_LOOP